# EAGLE design pj7 (EAGLE 7.3.2)
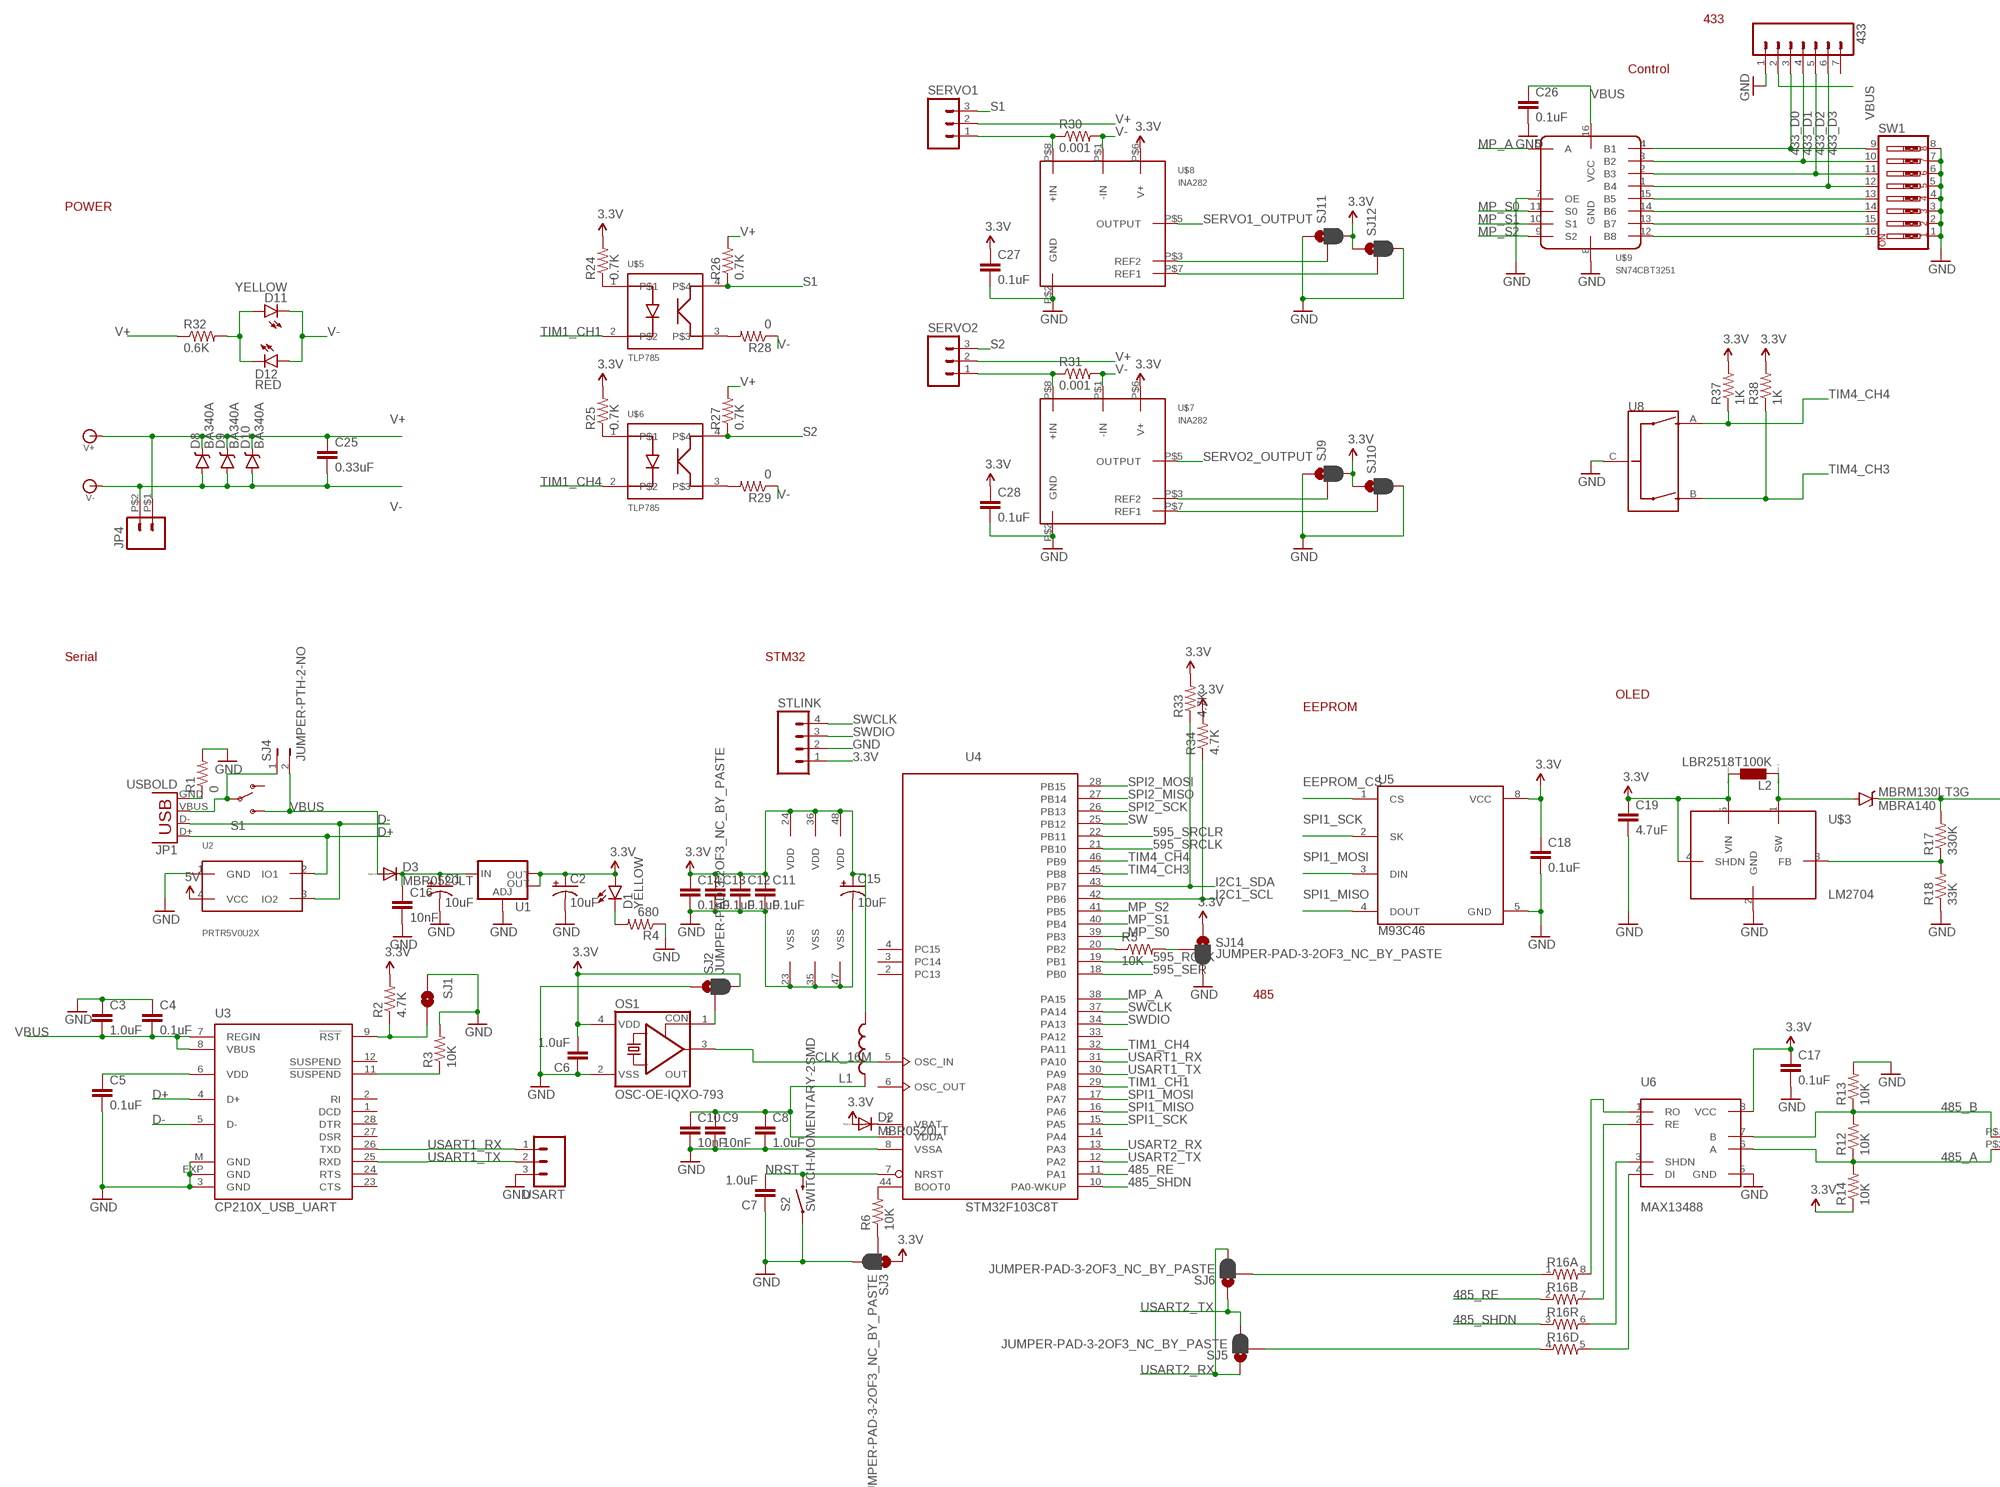
[diagram p0: schematic, sheet 1, part 1 of 2]
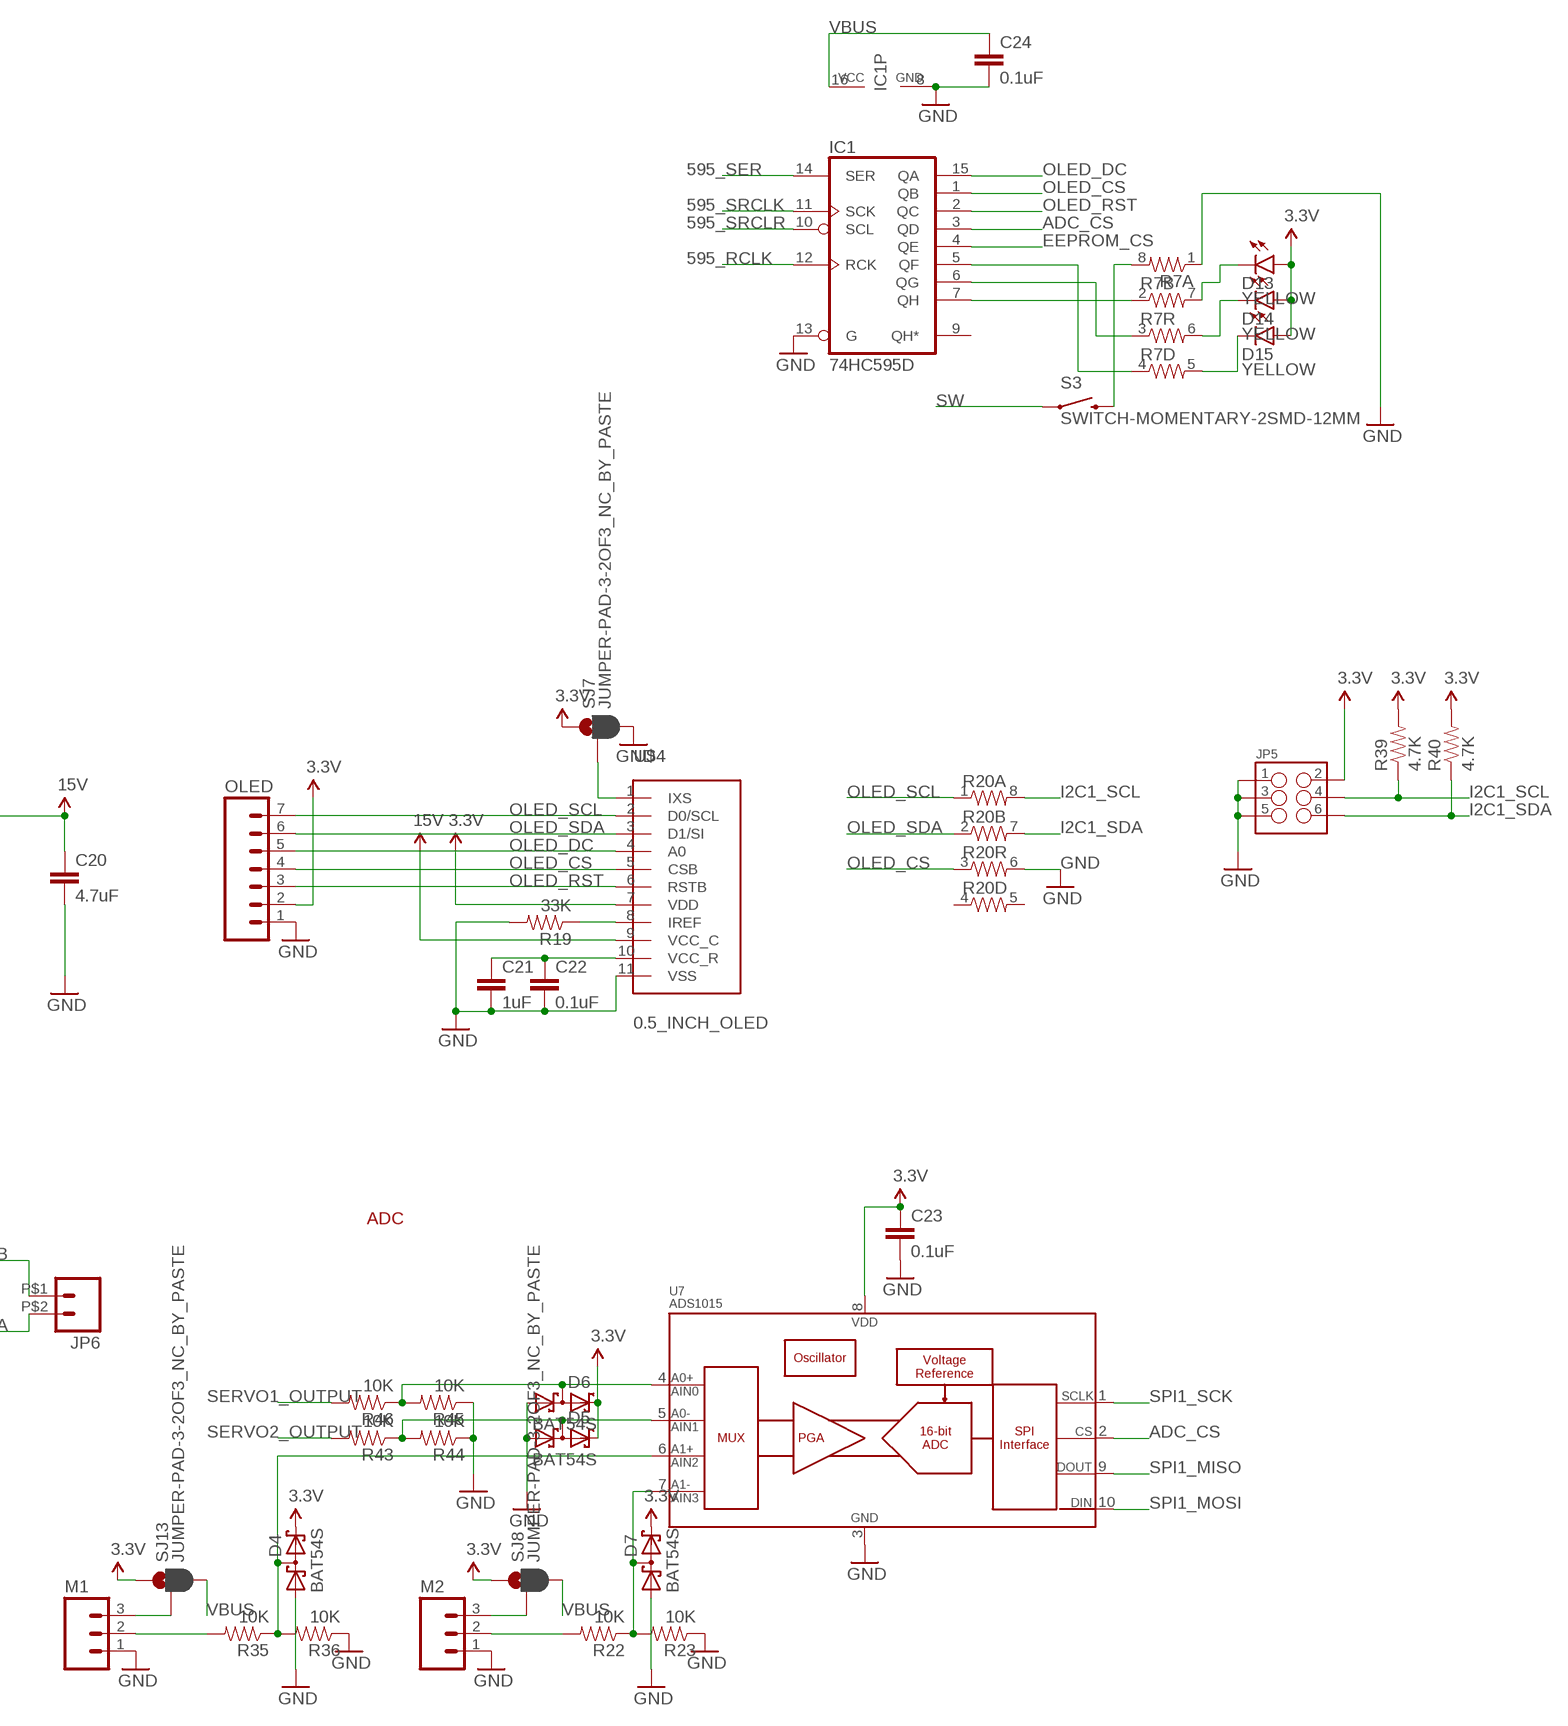
[diagram p1: schematic, sheet 1, part 2 of 2]

## Parts
433  M07LOCK  [1X07_LOCK]
C1  10uF  10UF-16V-10%(TANT)  [EIA3216]
C2  10uF  10UF-16V-10%(TANT)  [EIA3216]
C3  1.0uF  1.0UF-16V-10%(0603)  [0603-CAP]
C4  0.1uF  0.1UF-25V-5%(0603)  [0603-CAP]
C5  0.1uF  0.1UF-25V-5%(0603)  [0603-CAP]
C6  1.0uF  1.0UF-16V-10%(0603)  [0603-CAP]
C7  1.0uF  1.0UF-16V-10%(0603)  [0603-CAP]
C8  1.0uF  1.0UF-16V-10%(0603)  [0603-CAP]
C9  10nF  10NF/10000PF-50V-10%(0603)  [0603-CAP]
C10  10nF  10NF/10000PF-50V-10%(0603)  [0603-CAP]
C11  0.1uF  0.1UF-25V-5%(0603)  [0603-CAP]
C12  0.1uF  0.1UF-25V-5%(0603)  [0603-CAP]
C13  0.1uF  0.1UF-25V-5%(0603)  [0603-CAP]
C14  0.1uF  0.1UF-25V-5%(0603)  [0603-CAP]
C15  10uF  10UF-16V-10%(TANT)  [EIA3216]
C16  10nF  10NF/10000PF-50V-10%(0603)  [0603-CAP]
C17  0.1uF  0.1UF-25V-5%(0603)  [0603-CAP]
C18  0.1uF  0.1UF-25V-5%(0603)  [0603-CAP]
C19  4.7uF  0.1UF-25V-5%(0603)  [0603-CAP]
C20  4.7uF  0.1UF-25V-5%(0603)  [0603-CAP]
C21  1uF  0.1UF-25V-5%(0603)  [0603-CAP]
C22  0.1uF  0.1UF-25V-5%(0603)  [0603-CAP]
C23  0.1uF  0.1UF-25V-5%(0603)  [0603-CAP]
C24  0.1uF  0.1UF-25V-5%(0603)  [0603-CAP]
C25  0.33uF  0.33UF-50V-10%(0805)  [0805-CAP]
C26  0.1uF  0.1UF-25V-5%(0603)  [0603-CAP]
C27  0.1uF  0.1UF-25V-5%(0603)  [0603-CAP]
C28  0.1uF  0.1UF-25V-5%(0603)  [0603-CAP]
D1  YELLOW  LED-YELLOW1206  [LED-1206]
D2  MBR0520LT  [SOD123]
D3  MBR0520LT  [SOD123]
D4  BAT54S  [SOT23]
D5  BAT54S  [SOT23]
D6  BAT54S  [SOT23]
D7  BAT54S  [SOT23]
D8  BA340A  B340A  [SMA-DIODE]
D9  BA340A  B340A  [SMA-DIODE]
D10  BA340A  B340A  [SMA-DIODE]
D11  YELLOW  LED-YELLOW1206  [LED-1206]
D12  RED  LED-RED1206  [LED-1206]
D13  YELLOW  LED-YELLOW1206  [LED-1206]
D14  YELLOW  LED-YELLOW1206  [LED-1206]
D15  YELLOW  LED-YELLOW1206  [LED-1206]
IC1  74HC595D  [SO16]
JP1  USBOLD  [USB-MINIB-OLD]
JP4  M02  [1X02_5.08]
JP5  M03X2  [2X3_SMD]
JP6  M02  [1X02_5.08]
L1  INDUCTOR0603  [0603]
L2  LBR2518T100K  LL3225P  [L3225P]
M1  M03LOCK  [1X03_LOCK]
M2  M03LOCK  [1X03_LOCK]
MBRM130LT3G  MBRA140  [SMA-DIODE]
OLED  M07LOCK  [1X07_LOCK]
OS1  OSC-OE-IQXO-793  [2.5X2-4-PAD]
R1  0  0OHM-1/10W-5%(0603)  [0603]
R2  4.7K  4.7KOHM-1/10W-1%(0603)  [0603-RES]
R3  10K  4.7KOHM-1/10W-1%(0603)  [0603-RES]
R4  680  680OHM1/10W5%(0603)  [0603-RES]
R5  10K  10KOHM-1/10W-1%(0603)0603  [0603-RES]
R6  10K  10KOHM-1/10W-1%(0603)0603  [0603-RES]
R7  RESISTOR-ARRAY0603-ARV  [0603-ARV]
R12  10K  10KOHM-1/10W-1%(0603)0603  [0603-RES]
R13  10K  10KOHM-1/10W-1%(0603)0603  [0603-RES]
R14  10K  10KOHM-1/10W-1%(0603)0603  [0603-RES]
R16  RESISTOR-ARRAY0603-ARV  [0603-ARV]
R17  330K  10KOHM-1/10W-1%(0603)0603  [0603-RES]
R18  33K  10KOHM-1/10W-1%(0603)0603  [0603-RES]
R19  33K  10KOHM-1/10W-1%(0603)0603  [0603-RES]
R20  RESISTOR-ARRAY0603-ARV  [0603-ARV]
R22  10K  10KOHM-1/10W-1%(0603)0603  [0603-RES]
R23  10K  10KOHM-1/10W-1%(0603)0603  [0603-RES]
R24  0.7K  0OHM-1/10W-5%(0603)  [0603]
R25  0.7K  0OHM-1/10W-5%(0603)  [0603]
R26  0.7K  0OHM-1/10W-5%(0603)  [0603]
R27  0.7K  0OHM-1/10W-5%(0603)  [0603]
R28  0  0OHM-1/10W-5%(0603)  [0603]
R29  0  0OHM-1/10W-5%(0603)  [0603]
R30  0.001  0.001OHM-3W-1%(2512)3W/1%  [2512]
R31  0.001  0.001OHM-3W-1%(2512)3W/1%  [2512]
R32  0.6K  0.75OHM-1/4W-1%(0805)  [0805]
R33  4.7K  10KOHM-1/10W-1%(0603)0603  [0603-RES]
R34  4.7K  10KOHM-1/10W-1%(0603)0603  [0603-RES]
R35  10K  10KOHM-1/10W-1%(0603)0603  [0603-RES]
R36  10K  10KOHM-1/10W-1%(0603)0603  [0603-RES]
R37  1K  10KOHM-1/10W-1%(0603)0603  [0603-RES]
R38  1K  10KOHM-1/10W-1%(0603)0603  [0603-RES]
R39  4.7K  10KOHM-1/10W-1%(0603)0603  [0603-RES]
R40  4.7K  10KOHM-1/10W-1%(0603)0603  [0603-RES]
R43  10K  10KOHM-1/10W-1%(0603)0603  [0603-RES]
R44  10K  10KOHM-1/10W-1%(0603)0603  [0603-RES]
R45  10K  10KOHM-1/10W-1%(0603)0603  [0603-RES]
R46  10K  10KOHM-1/10W-1%(0603)0603  [0603-RES]
S1  SWITCH-SPDTSMD  [AYZ0202]
S2  SWITCH-MOMENTARY-2SMD  [TACTILE-SWITCH-SMD]
S3  SWITCH-MOMENTARY-2SMD-12MM  [TACTILE-SMD-12MM]
SERVO1  M03LOCK_LONGPADS  [1X03_LOCK_LONGPADS]
SERVO2  M03LOCK_LONGPADS  [1X03_LOCK_LONGPADS]
SJ1  JUMPER-PAD-2-NOYES_SILK  [PAD-JUMPER-2-NO_YES_SILK]
SJ2  JUMPER-PAD-3-2OF3_NC_BY_PASTE  [PAD-JUMPER-3-2OF3_NC_BY_PASTE_YES_SILK_FULL_BOX]
SJ3  JUMPER-PAD-3-2OF3_NC_BY_PASTE  [PAD-JUMPER-3-2OF3_NC_BY_PASTE_YES_SILK_FULL_BOX]
SJ4  JUMPER-PTH-2-NO  [PTH-JUMPER-2-NO_NO_SILK]
SJ5  JUMPER-PAD-3-2OF3_NC_BY_PASTE  [PAD-JUMPER-3-2OF3_NC_BY_PASTE_YES_SILK_FULL_BOX]
SJ6  JUMPER-PAD-3-2OF3_NC_BY_PASTE  [PAD-JUMPER-3-2OF3_NC_BY_PASTE_YES_SILK_FULL_BOX]
SJ7  JUMPER-PAD-3-2OF3_NC_BY_PASTE  [PAD-JUMPER-3-2OF3_NC_BY_PASTE_YES_SILK_FULL_BOX]
SJ8  JUMPER-PAD-3-2OF3_NC_BY_PASTE  [PAD-JUMPER-3-2OF3_NC_BY_PASTE_YES_SILK_FULL_BOX]
SJ9  JUMPER-PAD-3-2OF3_NC_BY_PASTE  [PAD-JUMPER-3-2OF3_NC_BY_PASTE_YES_SILK_FULL_BOX]
SJ10  JUMPER-PAD-3-2OF3_NC_BY_PASTE  [PAD-JUMPER-3-2OF3_NC_BY_PASTE_YES_SILK_FULL_BOX]
SJ11  JUMPER-PAD-3-2OF3_NC_BY_PASTE  [PAD-JUMPER-3-2OF3_NC_BY_PASTE_YES_SILK_FULL_BOX]
SJ12  JUMPER-PAD-3-2OF3_NC_BY_PASTE  [PAD-JUMPER-3-2OF3_NC_BY_PASTE_YES_SILK_FULL_BOX]
SJ13  JUMPER-PAD-3-2OF3_NC_BY_PASTE  [PAD-JUMPER-3-2OF3_NC_BY_PASTE_YES_SILK_FULL_BOX]
SJ14  JUMPER-PAD-3-2OF3_NC_BY_PASTE  [PAD-JUMPER-3-2OF3_NC_BY_PASTE_YES_SILK_FULL_BOX]
STLINK  M04LOCK  [1X04_LOCK]
SW1  SW_DIP-8-SMT-HALFSIZE  [DIPSWITCH-08-50MIL]
U1  V_REG_LM1117SOT223  [SOT223]
U2  PRTR5V0U2X  [SOT143]
U3  CP210X_USB_UART  [MLP28]
U4  STM32F103C8T  [LQFP48]
U5  M93C46  [SO08]
U6  MAX13488  [SOIC8]
U7  ADS1015  ADS1118  [MSOP10]
U8  ENCODER-QUADRATURE  [ENCODER-16MM-QUAD]
U$3  LM2704  [SOT23-5]
U$4  0.5_INCH_OLED  [BL125-11RL-TAGF]
U$5  TLP785  [DIL04]
U$6  TLP785  [DIL04]
U$7  INA282  [SOP8]
U$8  INA282  [SOP8]
U$9  SN74CBT3251  [TSSOP16]
USART  M03LOCK  [1X03_LOCK]
V+  BANANA_CONN  [BANANA_CONN]
V-  BANANA_CONN  [BANANA_CONN]

## Nets
3.3V: C2.A(+) C6.2 C11.1 C12.1 C13.1 C14.1 C15.A(+) C17.1 C18.1 C19.1 C23.1 C27.1 C28.1 D1.A D2.A D4.2(C2) D5.2(C2) D6.2(C2) D7.2(C2) D13.A D14.A D15.A JP5.2 L1.2 L2.1 OLED.2 OS1.4(VDD) R2.2 R14.1 R24.2 R25.2 R33.2 R34.2 R37.2 R38.2 R39.2 R40.2 SJ2.3 SJ3.1 SJ7.1 SJ8.1 SJ9.3 SJ10.1 SJ11.3 SJ12.1 SJ13.1 SJ14.1 STLINK.1 U1.2(OUT) U1.4(OUT) U4.24(VDD) U4.36(VDD) U4.48(VDD) U5.8(VCC) U6.8(VCC) U7.8(VDD) U$3.4(SHDN) U$3.5(VIN) U$4.7(VDD) U$7.P$6(V+) U$8.P$6(V+)
5V: U2.4(VCC)
15V: C20.1 MBRM130LT3G.C R17.2 U$4.9(VCC_C)
433_D0: 433.3 SW1.9 U$9.4(B1)
433_D1: 433.4 SW1.10 U$9.3(B2)
433_D2: 433.5 SW1.11 U$9.2(B3)
433_D3: 433.6 SW1.12 U$9.1(B4)
485_A: JP6.P$2 R12.1 R14.2 U6.6(A)
485_B: JP6.P$1 R12.2 R13.1 U6.7(B)
485_RE: R16.2 U4.11(PA1)
485_SHDN: R16.3 U4.10(PA0-WKUP)
595_RCLK: IC1.12(RCK) U4.19(PB1)
595_SER: IC1.14(SER) U4.18(PB0)
595_SRCLK: IC1.11(SCK) U4.21(PB10)
595_SRCLR: IC1.10(SCL) U4.22(PB11)
ADC_CS: IC1.3(QD) U7.2(CS)
CLK_16M: OS1.3(OUT) U4.5(OSC_IN)
D+: JP1.D+ U2.2(IO1) U3.4(D+)
D-: JP1.D- U2.3(IO2) U3.5(D-)
EEPROM_CS: IC1.4(QE) U5.1(CS)
GND: 433.1 C1.C(-) C2.C(-) C3.1 C4.1 C5.2 C6.1 C7.1 C8.2 C9.2 C10.2 C11.2 C12.2 C13.2 C14.2 C15.C(-) C16.2 C17.2 C18.2 C19.2 C20.2 C21.2 C22.2 C23.2 C24.2 C26.2 C27.2 C28.2 D4.1(A1) D5.1(A1) D6.1(A1) D7.1(A1) IC1.8(GND) IC1.13(G) JP5.1 JP5.3 JP5.5 M1.1 M2.1 OLED.1 OS1.2(VSS) R1.2 R3.2 R4.1 R7.1 R13.2 R18.1 R19.2 R20.6 R23.1 R36.1 R44.1 R45.1 S2.1 SJ1.2 SJ2.1 SJ3.3 SJ7.3 SJ9.1 SJ10.3 SJ11.1 SJ12.3 SJ14.3 STLINK.2 SW1.1 SW1.2 SW1.3 SW1.4 SW1.5 SW1.6 SW1.7 SW1.8 U1.1(ADJ) U2.1(GND) U3.3(GND) U3.EXP(GND) U3.M(GND) U4.8(VSSA) U4.23(VSS) U4.35(VSS) U4.47(VSS) U5.5(GND) U6.5(GND) U7.3(VSS) U8.C U$3.2(GND) U$4.11(VSS) U$7.P$2(GND) U$8.P$2(GND) U$9.7(OE) U$9.8(GND) USART.3
I2C1_SCL: JP5.4 R20.8 R34.1 R39.1 U4.42(PB6)
I2C1_SDA: JP5.6 R20.7 R33.1 R40.1 U4.43(PB7)
MP_A: U4.38(PA15) U$9.5(A)
MP_S0: U4.39(PB3) U$9.11(S0)
MP_S1: U4.40(PB4) U$9.10(S1)
MP_S2: U4.41(PB5) U$9.9(S2)
N$1: JP1.GND R1.1
N$2: R3.1 U3.11(!SUSPEND)
N$3: D1.C R4.2
N$4: D2.C U4.1(VBAT)
N$5: JP1.VBUS S1.2(P) SJ4.1
N$6: C8.1 C9.1 C10.1 L1.1 U4.9(VDDA)
N$7: R6.2 U4.44(BOOT0)
N$9: R6.1 SJ3.2
N$10: R2.1 SJ1.1 U3.9(!RST)
N$11: OS1.1(CON) SJ2.2
N$12: C1.A(+) C16.1 D3.C U1.3(IN)
N$14: R17.1 R18.2 U$3.3(FB)
N$15: C5.1 U3.6(VDD)
N$16: IC1.7(QH) R7.2
N$17: IC1.6(QG) R7.3
N$18: L2.2 MBRM130LT3G.A U$3.1(SW)
N$19: IC1.5(QF) R7.4
N$20: C21.1 C22.1 U$4.10(VCC_R)
N$21: SJ7.2 U$4.1(IXS)
N$22: D15.C R7.5
N$23: D14.C R7.6
N$24: R16.8 U6.1(RO)
N$25: R16.6 U6.3(SHDN)
N$26: R16.5 U6.4(DI)
N$27: R16.7 U6.2(RE)
N$28: R16.1 SJ6.2
N$29: R24.1 U$5.1
N$30: M2.2 R22.2
N$31: R16.4 SJ5.2
N$32: R19.1 U$4.8(IREF)
N$33: D7.3(C1A2) R22.1 R23.2 U7.7(AIN3)
N$34: R25.1 U$6.1
N$35: R30.1 SERVO1.1 U$8.P$8(+IN)
N$36: M2.3 SJ8.2
N$37: R31.1 SERVO2.1 U$7.P$8(+IN)
N$38: R28.2 U$5.3
N$39: R29.2 U$6.3
N$40: SJ9.2 U$7.P$3(REF2)
N$41: SJ10.2 U$7.P$7(REF1)
N$42: SJ11.2 U$8.P$3(REF2)
N$43: SJ12.2 U$8.P$7(REF1)
N$44: D11.A D12.C R32.2
N$45: M1.3 SJ13.2
N$46: D4.3(C1A2) R35.1 R36.2 U7.6(AIN2)
N$47: M1.2 R35.2
N$48: R5.2 SJ14.2
N$49: D5.3(C1A2) R43.1 R44.2 U7.5(AIN1)
N$50: D6.3(C1A2) R45.2 R46.1 U7.4(AIN0)
N$55: SW1.13 U$9.15(B5)
N$56: SW1.14 U$9.14(B6)
N$57: SW1.15 U$9.13(B7)
N$58: SW1.16 U$9.12(B8)
N$59: D13.C R7.7
N$63: R7.8 S3.3
NRST: C7.2 S2.3 U4.7(NRST)
OLED_CS: IC1.1(QB) OLED.4 R20.3 U$4.5(CSB)
OLED_DC: IC1.15(QA) OLED.5 U$4.4(A0)
OLED_RST: IC1.2(QC) OLED.3 U$4.6(RSTB)
OLED_SCL: OLED.7 R20.1 U$4.2(D0/SCL)
OLED_SDA: OLED.6 R20.2 U$4.3(D1/SI)
OURET: R5.1 U4.20(PB2)
S1: R26.1 SERVO1.3 U$5.4
S2: R27.1 SERVO2.3 U$6.4
SERVO1_OUTPUT: R46.2 U$8.P$5(OUTPUT)
SERVO2_OUTPUT: R43.2 U$7.P$5(OUTPUT)
SPI1_MISO: U4.16(PA6) U5.4(DOUT) U7.9(DOUT/DRDY)
SPI1_MOSI: U4.17(PA7) U5.3(DIN) U7.10(DIN)
SPI1_SCK: U4.15(PA5) U5.2(SK) U7.1(SCLK)
SPI2_MISO: U4.27(PB14)
SPI2_MOSI: U4.28(PB15)
SPI2_SCK: U4.26(PB13)
SW: S3.1 U4.25(PB12)
SWCLK: STLINK.4 U4.37(PA14)
SWDIO: STLINK.3 U4.34(PA13)
TIM1_CH1: U4.29(PA8) U$5.2
TIM1_CH4: U4.32(PA11) U$6.2
TIM4_CH3: R38.1 U4.45(PB8) U8.B
TIM4_CH4: R37.1 U4.46(PB9) U8.A
USART1_RX: U3.26(TXD) U4.31(PA10) USART.1
USART1_TX: U3.25(RXD) U4.30(PA9) USART.2
USART2_RX: SJ5.1 SJ6.3 U4.13(PA3)
USART2_TX: SJ5.3 SJ6.1 U4.12(PA2)
V+: C25.1 D8.C D9.C D10.C JP4.P$1 R26.2 R27.2 R32.1 SERVO1.2 SERVO2.2 V+.P$1
V-: C25.2 D8.A D9.A D10.A D11.C D12.A JP4.P$2 R28.1 R29.1 R30.2 R31.2 U$7.P$1(-IN) U$8.P$1(-IN) V-.P$1
VBUS: 433.2 C3.2 C4.2 C24.1 C26.1 D3.A IC1.16(VCC) S1.3(S) SJ4.2 SJ8.3 SJ13.3 U3.7(REGIN) U3.8(VBUS) U$9.16(VCC)
Unconnected: 433.7 IC1.9(QH*) R20.4 R20.5 S1.1(O) U3.1(DCD) U3.2(RI) U3.12(SUSPEND) U3.23(CTS) U3.24(RTS) U3.27(DSR) U3.28(DTR) U4.2(PC13) U4.3(PC14) U4.4(PC15) U4.6(OSC_OUT) U4.14(PA4) U4.33(PA12)

## Notes on the sheet
- 433
- Control
- POWER
- Serial | STM32
- OLED
- EEPROM
- 485
- ADC

## Library data of the parts
433 OLED = SparkFun-Connectors:M07: Header 7 Standard 7-pin 0.1" header. Use with straight break away headers (SKU : PRT-00116), right angle break away headers (PRT-00553), swiss pins (PRT-00743), machine pins (PRT-00117), and female headers (PRT-00115). NOTES ON THE VARIANTS LOCK and LOCK_LONGPADS... This footprint was designed to help hold the alignment of a through-hole component (i.e. 7-pin header) while soldering it into place. You may notice that each hole has been shifted either up or down by 0.005 of an inch from it's more standard position (which is usually a perfectly straight line). This slight alteration caused the pins (the squares in the middle) to touch the edges of the holes. Because they are alternating, it causes a "brace" to hold the header in place. 0.005 has proven to be the perfect amount of "off-center" position when using our standard breakaway headers. Although looks a little odd when you look at the bare footprint, once you have a header in there, the alteration is very hard to notice. Also, if you push a header all the way into place, it is covered up entirely on the bottom side. This idea of altering the position of holes to aid alignment will be further integrated into the Sparkfun Library for other footprints. It can help hold any component with 3 or more connection pins.
C1 C2 C15 = SparkFun-Capacitors:10UF-16V-10%(TANT): CAP-00811 1206/EIA-3216 Tantalum capacitor; PROD_ID: CAP-00811
C3 C6-C8 = SparkFun-Capacitors:1.0UF-16V-10%(0603): CAP-00868; PROD_ID: CAP-00868
C4 C5 C11-C14 C17 C18 C22-C24 C26-C28 = SparkFun-Capacitors:0.1UF-25V-5%(0603): CAP-08604; PROD_ID: CAP-08604
C9 C10 C16 = SparkFun-Capacitors:10NF/10000PF-50V-10%(0603): CAP-00867; PROD_ID: CAP-00867
C19-C21 = SparkFun-Capacitors:0.1UF-25V-5%(0603): CAP-08604; PROD_ID: CAP-08604; VALUE: 0.1uF
C25 = SparkFun-Capacitors:0.33UF-50V-10%(0805): CAP-08469; PROD_ID: CAP-08469
D1 D11 D13-D15 = SparkFun-LED:LED-YELLOW: Yellow SMD LEDs LilyPad 1206- DIO-09909 0603- DIO-09003 "SMART" means more efficient and expensive; PROD_ID: DIO-00820
D2 D3 = diode:MBR0520LT: SCHOTTKY BARRIER RECTIFIER Source: http://onsemi.com .. MBR0520LT1-D.pdf
D4-D7 = diode:BAT54S: Schottky Diodes Pin connection corrected 2011-05-04 Source: Fairchild .. BAT54.pdf
D8-D10 = SparkFun-DiscreteSemi:B340A: Schottky Diode 3A-40V; PROD_ID: DIO-09886
D12 = SparkFun-LED:LED-RED: Assorted Red LEDs LilyPad 1206- DIO-09912 1206- DIO-00809 0603- DIO-00819 "SMART" means more efficient and expensive; PROD_ID: DIO-09912
IC1 = 74xx-eu:74*595: 8-bit SHIFT REGISTER, output latch
JP1 = SparkFun-Connectors:USB: USB Connectors USB-B-PTH is fully proven SKU : PRT-00139/CONN-08278 USB-miniB is fully proven SKU : PRT-00587 USB-A-PCB is untested. USB-A-H is throughly reviewed, but untested. Spark Fun Electronics SKU : PRT-00437 USB-B-SMT is throughly reviewed, but untested. Needs silkscreen touching up. USB-A-S has not been used/tested USB-MB-H has not been used/tested USB-MICROB has been used. CONN-09505
JP4 JP6 = SparkFun-Connectors:M02: Standard 2-pin 0.1" header. Use with - straight break away headers ( PRT-00116) - right angle break away headers (PRT-00553) - swiss pins (PRT-00743) - machine pins (PRT-00117) - female headers (PRT-00115) Molex polarized connector foot print use with: PRT-08233 with associated crimp pins and housings. 2.54_SCREWTERM for use with PRT-10571. 3.5mm Screw Terminal footprints for PRT-08084 5mm Screw Terminal footprints for use with PRT-08432
JP5 = SparkFun-Connectors:M03X2: 2x3 .1" header. Shrouded, with keying- CONN-10681 SMT- CONN-11415 Pogo pins- HW-11044; PROD_ID: CONN-11290
L1 = SparkFun-Passives:INDUCTOR: Inductors Basic Inductor/Choke - 0603 and 1206. Footprints are not proven and vary greatly between part numbers. INDUCTOR POWER 3.3UH 4.0A SMD 0.197" L x 0.197" W x 0.177" H (5.00mm x 5.00mm x 4.50mm)
L2 = eagle-ltspice:L: INDUCTOR, European symbol; SPICEMODEL: NONE; SPICEPREFIX: L
M1 M2 SERVO1 SERVO2 USART = SparkFun-Connectors:M03: Header 3 Standard 3-pin 0.1" header. Use with straight break away headers (SKU : PRT-00116), right angle break away headers (PRT-00553), swiss pins (PRT-00743), machine pins (PRT-00117), and female headers (PRT-00115). Molex polarized connector foot print use with SKU : PRT-08232 with associated crimp pins and housings.
MBRM130LT3G = SparkFun-DiscreteSemi:MBRA140: 40V, 1A Schottky rectifier SMA/DO-214AC package DIO-08053; PROD_ID: DIO-08053
OS1 = IQD-Frequency-Products:OSC-OE: OSCILLATOR WITH OE
R1 R28 R29 = SparkFun-Resistors:0OHM-1/10W-5%(0603): RES-08609; PROD_ID: RES-08609
R2 = SparkFun-Resistors:4.7KOHM-1/10W-1%(0603): RES-07857; PROD_ID: RES-07857
R3 = SparkFun-Resistors:4.7KOHM-1/10W-1%(0603): RES-07857; PROD_ID: RES-07857; VALUE: 4.7K
R4 = SparkFun-Resistors:680OHM1/10W5%(0603): RES-09333; PROD_ID: RES-09333
R5 R6 R12-R14 R22 R23 R35 R36 R43-R46 = SparkFun-Resistors:10KOHM-1/10W-1%(0603): RES-00824; PROD_ID: RES-00824
R7 R16 R20 = SparkFun-Resistors:RESISTOR-ARRAY: Array Chip Resistor Source: RS Component / Phycomp
R17-R19 R33 R34 R37-R40 = SparkFun-Resistors:10KOHM-1/10W-1%(0603): RES-00824; PROD_ID: RES-00824; VALUE: 10K
R24-R27 = SparkFun-Resistors:0OHM-1/10W-5%(0603): RES-08609; PROD_ID: RES-08609; VALUE: 0
R30 R31 = SparkFun-Resistors:0.001OHM-3W-1%(2512); PROD_ID: RES-12449
R32 = SparkFun-Resistors:0.75OHM-1/4W-1%(0805): RES-08474; PROD_ID: RES-08474; VALUE: 0.75
S1 = SparkFun-Electromechanical:SWITCH-SPDT: SPDT Switch Simple slide switch, Spark Fun Electronics SKU : COM-00102 DPDT SMT slide switch, AYZ0202, SWCH-08179; PROD_ID: SWCH-08179; SF_ID: COM-00597
S2 = SparkFun-Electromechanical:SWITCH-MOMENTARY-2: Various NO switches- pushbuttons, reed, etc; PROD_ID: SWCH-08247
S3 = SparkFun-Electromechanical:SWITCH-MOMENTARY-2: Various NO switches- pushbuttons, reed, etc
SJ1 = SparkFun-Passives:JUMPER-PAD-2-NO
SJ2 SJ3 SJ5-SJ14 = SparkFun-Passives:JUMPER-PAD-3-2OF3_NC_BY_PASTE
SJ4 = SparkFun-Passives:JUMPER-PTH-2-NO
STLINK = SparkFun-Connectors:M04: Header 4 Standard 4-pin 0.1" header. Use with straight break away headers (SKU : PRT-00116), right angle break away headers (PRT-00553), swiss pins (PRT-00743), machine pins (PRT-00117), and female headers (PRT-00115). Molex polarized connector foot print use with SKU : PRT-08231 with associated crimp pins and housings. 1MM SMD Version SKU: PRT-10208
SW1 = SparkFun-Electromechanical:SW_DIP-8: DIP Switch 8 Position
U1 = SparkFun-PowerIC:V_REG_LM1117: Voltage Regulator LM1117 Standard adjustable voltage regulator but in SMD form. Spark Fun Electronics SKU : COM-00595; PROD_ID: VREG-08170
U2 = semicon-smd-ipc:PRTR5V0U2X
U3 = SparkFun-DigitalIC:CP210X_USB_UART: Single-Chip USB to UART Bridge Source: www.silabs.com .. CP2101.pdf / cp2102.pdf. Spark Fun Electronics SKU : COM-00310
U4 = micro-stm_v3:STM32F103C*T: ARM 32-bit Cortex™-M3 CPU 72 MHz maximum frequency 16 to 128 Kbytes of Flash memory 6 to 20 kbytes of SRAM 37 GPIOs 2.0 to 3.6 V application supply
U5 = SparkFun-DigitalIC:M93C46: 1kbit SPI EEPROM
U6 = SparkFun-DigitalIC:MAX13488
U7 = SparkFun-AnalogIC:ADS1118: 12-Bit Del-Sig ADC Four single-ended inputs or two differential inputs Internal PGA I2C interface 2.0-5.5V; PROD_ID: IC-12239
U8 = SparkFun-Electromechanical:ENCODER-QUADRATURE: quadrature encoder from Top-Up, part#EC16PHBF-B-20F-24-24C-16Y
U$3 = SparkFun-PowerIC:LM2704
U$4 = r1:0.5_INCH_OLED
U$5 U$6 = SparkFun-DigitalIC:TLP785
U$7 U$8 = SparkFun-PowerIC:INA282
U$9 = SparkFun-DigitalIC:SN74CBT3251
V+ V- = SparkFun-Connectors:BANANA_CONN: Through-hole banana jack

## Board
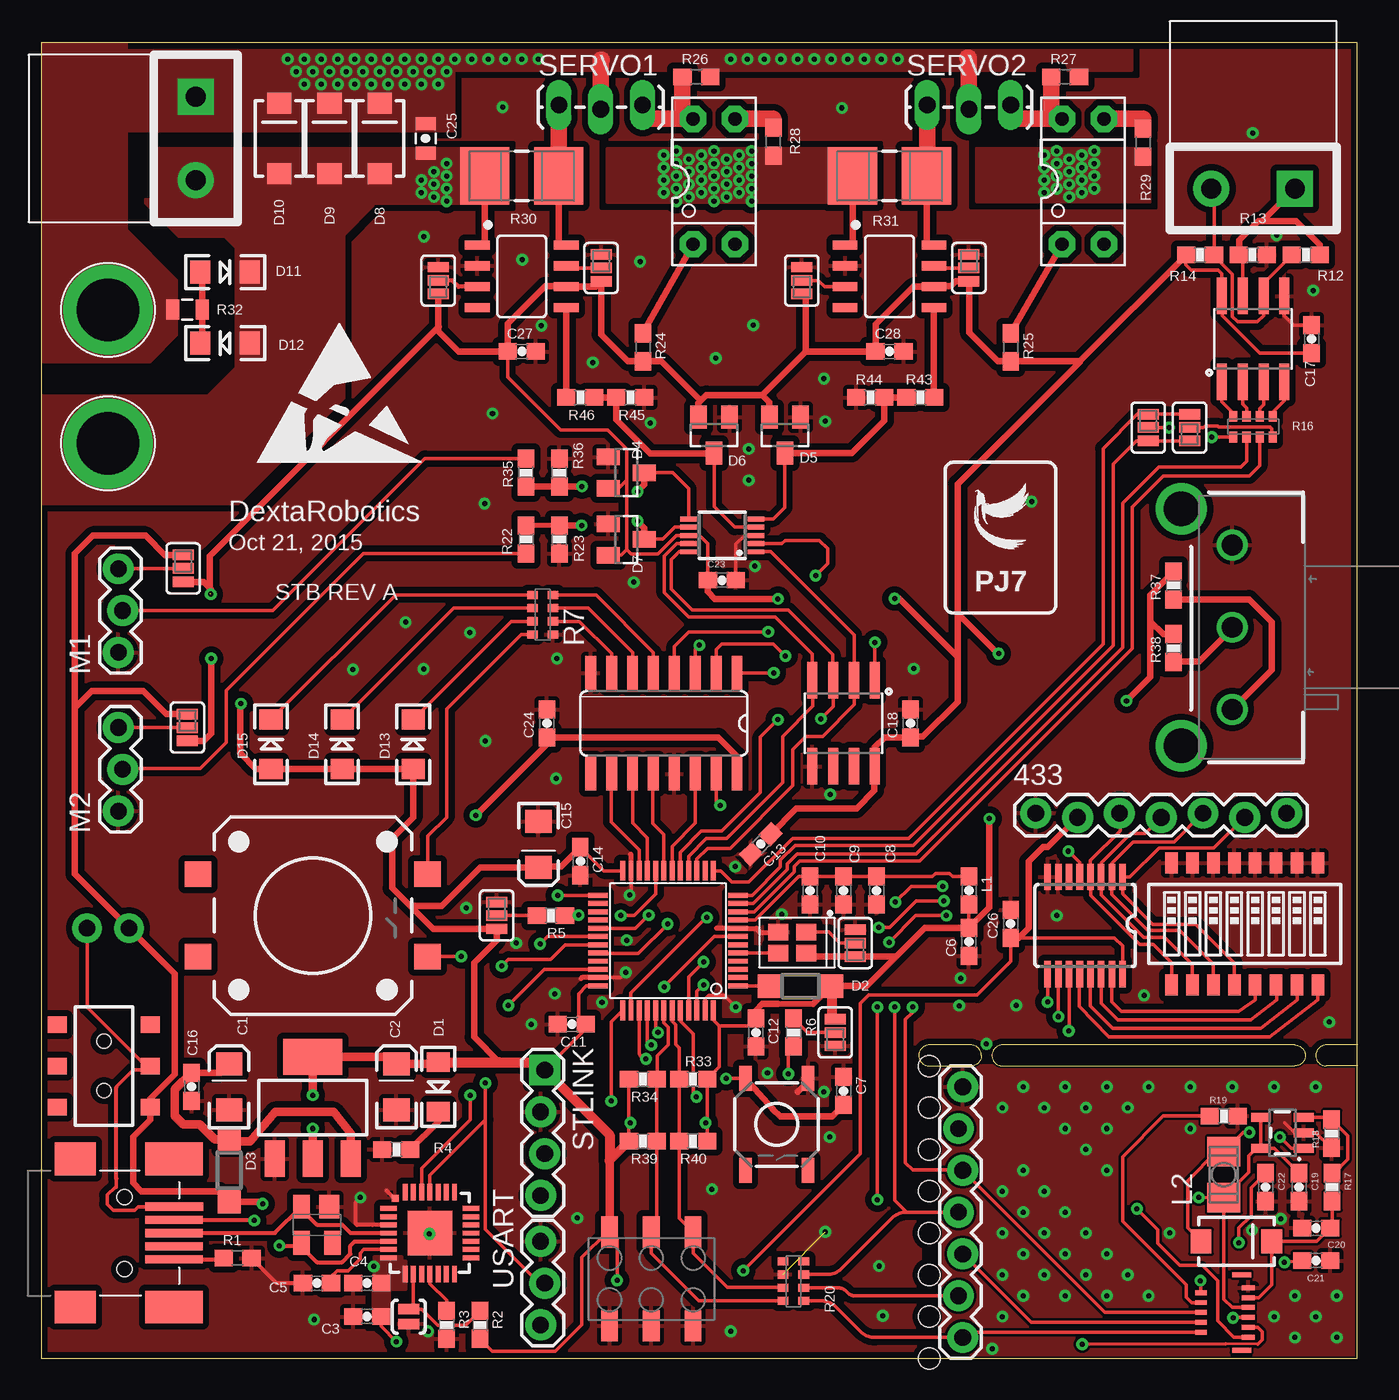
[diagram p2: board, top side]
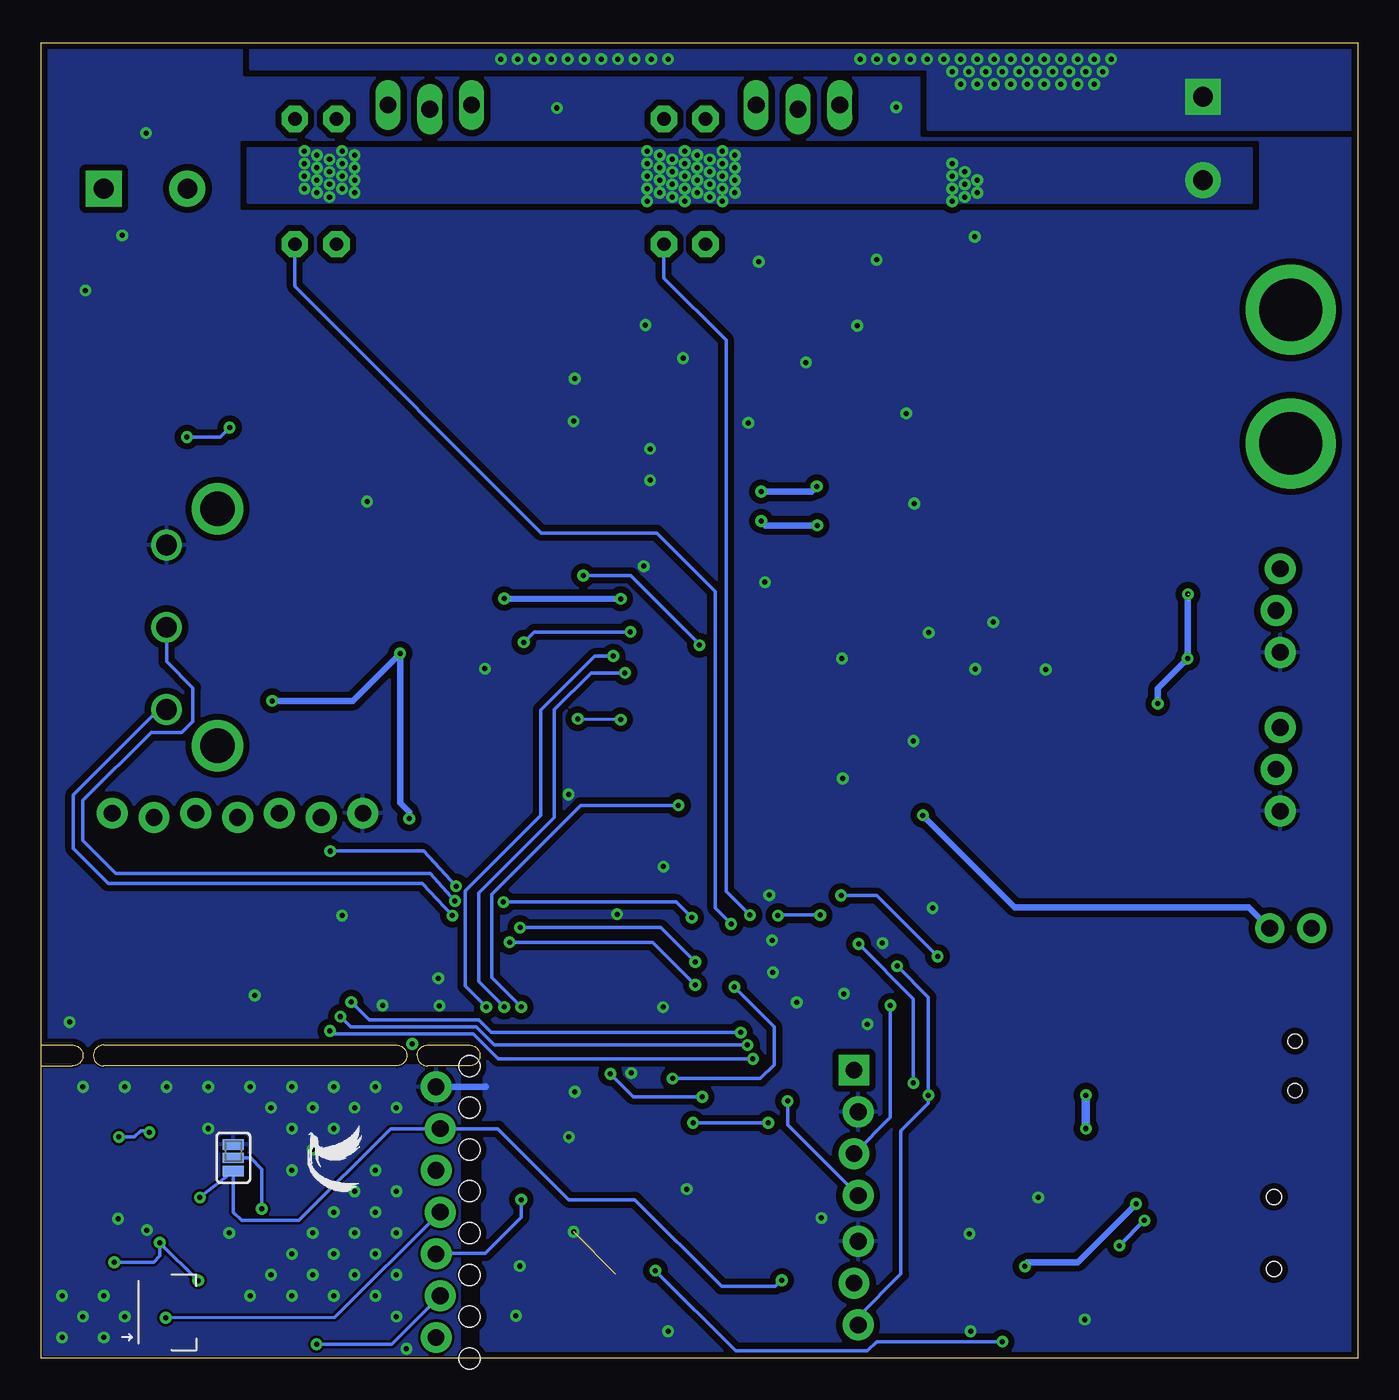
[diagram p3: board, bottom side, seen from below]

Size 80.01 x 80 mm. Coordinates in mm from the lower left corner, seen from the top.
Outline: 80.01,17.78 78.11,17.78 arc-90 77.47,18.41 arc-90 78.11,19.05 80.01,19.05
Outline: 0,0 80,0 80,80 0,80 0,0
Outline: 76.2,19.05 58.42,19.05 arc90 57.78,18.41 arc90 58.42,17.78 76.2,17.78 arc90 76.83,18.41 arc90 76.2,19.05
Outline: 53.98,17.78 56.52,17.78 arc90 57.15,18.41 arc90 56.52,19.05 53.98,19.05 arc90 53.34,18.41 arc90 53.98,17.78
Copper layers (1*16): Top 0.035mm / dielectric 1.5mm / Bottom 0.035mm
Design rules "default *": minimum track width 6mil, minimum drill 12mil, track to track 6mil, track to pad 6mil, pad to pad 6mil, via to via 6mil, smd to smd 6mil, copper to edge 1mil, drill to drill 6mil, minimum pad ring 10mil, minimum via ring 8mil, stop-mask expansion 0mil, vias tented up to drill 15mil, thermal gap 10mil
Holes 1.27 mm at 53.98,15.24 53.98,12.7 53.98,10.16 53.98,7.62 53.98,5.08 53.98,2.54 53.98,0 53.98,17.78

### Footprints (pad centres in the part's own frame; a part is rotated, then mirrored left to right if it is on the bottom)
1X07_LOCK = drill 1.016 pad 1.88: 1 0,0.127; 2 2.54,-0.127; 3 5.08,0.127; 4 7.62,-0.127; 5 10.16,0.127; 6 12.7,-0.127; 7 15.24,0.127
EIA3216 = smd 1.4 x 1.6: A 1.4,0; C -1.4,0
0603-CAP = smd 1.1 x 1: 1 -0.85,0; 2 0.85,0
0805-CAP = smd 0.8 x 1.2: 1 -0.9,0; 2 0.9,0
LED-1206 = smd 1.2 x 1.4: A -1.5,0; C 1.5,0
SOD123 = smd 1.4 x 1.4: A 1.9,0; C -1.9,0
SOT23 = smd 1 x 1.4: 1 -0.95,-1.1; 2 0.95,-1.1; 3 0,1.1
SMA-DIODE = smd 1.27 x 1.47: A -2.15,0; C 2.15,0
SO16 = smd 0.66 x 2.032: 1 -4.445,-3.073; 2 -3.175,-3.073; 3 -1.905,-3.073; 4 -0.635,-3.073; 5 0.635,-3.073; 6 1.905,-3.073; 7 3.175,-3.073; 8 4.445,-3.073; 9 4.445,3.073; 10 3.175,3.073; 11 1.905,3.073; 12 0.635,3.073; 13 -0.635,3.073; 14 -1.905,3.073; 15 -3.175,3.073; 16 -4.445,3.073
USB-MINIB-OLD = smd 2.5 x 2: 1 -3,-4.5; 2 -3,4.5 | smd 3.5 x 2: 3 3,-4.5; 4 3,4.5 | smd 3.5 x 0.5: D+ 3,0; D- 3,0.8; GND 3,-1.6; ID 3,-0.8; VBUS 3.01,1.61 | hole 0.9: 0,2.2; 0,-2.2
1X02_5.08 = drill 1.2 pad 2.184 square: P$1 -2.54,0 | drill 1.2 pad 2.184: P$2 2.54,0
2X3_SMD = smd 1.02 x 1.9: 1 -2.54,-2.85; 2 -2.54,2.85; 3 0,-2.85; 4 0,2.85; 5 2.54,-2.85; 6 2.54,2.85
0603 = smd 1.1 x 1: 1 -0.85,0; 2 0.85,0
L3225P = smd 1.8 x 2: 1 -1.4,0; 2 1.4,0
1X03_LOCK = drill 1.016 pad 1.88: 1 0,0.127; 2 2.54,-0.127; 3 5.08,0.127
2.5X2-4-PAD = smd 1.2 x 1: 1 -0.85,-0.65; 2 0.85,-0.65; 3 0.85,0.65; 4 -0.85,0.65
0603-RES = smd 1.1 x 1: 1 -0.85,0; 2 0.85,0
0603-ARV = smd 0.5 x 0.65: 1 -1.2,-0.625; 2 -0.4,-0.625; 3 0.4,-0.625; 4 1.2,-0.625; 5 1.2,0.625; 6 0.4,0.625; 7 -0.4,0.625; 8 -1.2,0.625
2512 = smd 3 x 3.5: 1 -2.25,0; 2 2.25,0
0805 = smd 0.8 x 1.2: 1 -0.9,0; 2 0.9,0
AYZ0202 = smd 1 x 1.15: 1 -2.5,2.825; 2 0,2.825; 3 2.5,2.825; 4 -2.5,-2.825; 5 0,-2.825; 6 2.5,-2.825 | hole 0.85: 1.5,0; -1.5,0
TACTILE-SWITCH-SMD = smd 1.524 x 0.762: 1 -2.794,1.905; 2 2.794,1.905; 3 -2.794,-1.905; 4 2.794,-1.905
TACTILE-SMD-12MM = smd 1.6 x 1.55: 1 6.975,-2.5; 2 -6.975,-2.5; 3 6.975,2.5; 4 -6.975,2.5
1X03_LOCK_LONGPADS = drill 1.016 long: 1 0,0; 2 2.54,-0.254; 3 5.08,0
PAD-JUMPER-2-NO_YES_SILK = smd 0.635 x 1.27: 1 -0.45,0; 2 0.45,0
PAD-JUMPER-3-2OF3_NC_BY_PASTE_YES_SILK_FULL_BOX = smd 0.635 x 1.27: 1 -0.813,0; 2 0,0; 3 0.813,0
PTH-JUMPER-2-NO_NO_SILK = drill 1.016 pad 1.778: 1 -1.27,0; 2 1.27,0
1X04_LOCK = drill 1.016 pad 1.88 square: 1 0,0.127 | drill 1.016 pad 1.88: 2 2.54,-0.127; 3 5.08,0.127; 4 7.62,-0.127
DIPSWITCH-08-50MIL = smd 0.762 x 1.27: 1 -4.445,-3.7; 2 -3.175,-3.7; 3 -1.905,-3.7; 4 -0.635,-3.7; 5 0.635,-3.7; 6 1.905,-3.7; 7 3.175,-3.7; 8 4.445,-3.7; 9 4.445,3.7; 10 3.175,3.7; 11 1.905,3.7; 12 0.635,3.7; 13 -0.635,3.7; 14 -1.905,3.7; 15 -3.175,3.7; 16 -4.445,3.7
SOT223 = smd 1.219 x 2.235: 1 -2.311,-3.099; 2 0,-3.099; 3 2.311,-3.099 | smd 3.6 x 2.2: 4 0,3.099
SOT143 = smd 1.2 x 1.44: 1 -0.75,-1.1 | smd 1 x 1.44: 2 0.95,-1.1; 3 0.95,1.1; 4 -0.95,1.1
MLP28 = smd 1 x 0.3: 1 -2.5,1.5; 2 -2.5,1; 3 -2.5,0.5; 4 -2.5,0; 5 -2.5,-0.5; 6 -2.5,-1; 7 -2.5,-1.5; 15 2.5,-1.5; 16 2.5,-1; 17 2.5,-0.5; 18 2.5,0; 19 2.5,0.5; 20 2.5,1; 21 2.5,1.5 | smd 0.3 x 1: 8 -1.5,-2.5; 9 -1,-2.5; 10 -0.5,-2.5; 11 0,-2.5; 12 0.5,-2.5; 13 1,-2.5; 14 1.5,-2.5; 22 1.5,2.5; 23 1,2.5; 24 0.5,2.5; 25 0,2.5; 26 -0.5,2.5; 27 -1,2.5; 28 -1.5,2.5 | smd 2.7 x 2.7: EXP 0,0 | smd 0.435 x 0.435: M -2.103,2.103
LQFP48 = smd 0.3 x 1.2: 1 -2.75,-4.25; 2 -2.25,-4.25; 3 -1.75,-4.25; 4 -1.25,-4.25; 5 -0.75,-4.25; 6 -0.25,-4.25; 7 0.25,-4.25; 8 0.75,-4.25; 9 1.25,-4.25; 10 1.75,-4.25; 11 2.25,-4.25; 12 2.75,-4.25; 25 2.75,4.25; 26 2.25,4.25; 27 1.75,4.25; 28 1.25,4.25; 29 0.75,4.25; 30 0.25,4.25; 31 -0.25,4.25; 32 -0.75,4.25; 33 -1.25,4.25; 34 -1.75,4.25; 35 -2.25,4.25; 36 -2.75,4.25 | smd 1.2 x 0.3: 13 4.25,-2.75; 14 4.25,-2.25; 15 4.25,-1.75; 16 4.25,-1.25; 17 4.25,-0.75; 18 4.25,-0.25; 19 4.25,0.25; 20 4.25,0.75; 21 4.25,1.25; 22 4.25,1.75; 23 4.25,2.25; 24 4.25,2.75; 37 -4.25,2.75; 38 -4.25,2.25; 39 -4.25,1.75; 40 -4.25,1.25; 41 -4.25,0.75; 42 -4.25,0.25; 43 -4.25,-0.25; 44 -4.25,-0.75; 45 -4.25,-1.25; 46 -4.25,-1.75; 47 -4.25,-2.25; 48 -4.25,-2.75
SO08 = smd 0.61 x 2.21: 1 -1.905,-2.616; 2 -0.635,-2.616; 3 0.635,-2.616; 4 1.905,-2.616; 5 1.905,2.616; 6 0.635,2.616; 7 -0.635,2.616; 8 -1.905,2.616
SOIC8 = smd 0.61 x 2.21: 1 -1.905,-2.616; 2 -0.635,-2.616; 3 0.635,-2.616; 4 1.905,-2.616; 5 1.905,2.616; 6 0.635,2.616; 7 -0.635,2.616; 8 -1.905,2.616
MSOP10 = smd 0.3 x 1: 1 -1,-2.05; 2 -0.5,-2.05; 3 0,-2.05; 4 0.5,-2.05; 5 1,-2.05; 6 1,2.05; 7 0.5,2.05; 8 0,2.05; 9 -0.5,2.05; 10 -1,2.05
ENCODER-16MM-QUAD = drill 1.25: A 0,-5; B 0,0; C 0,5 | drill 2.1: P$1 -3.1,7.2; P$2 -3.1,-7.2
SOT23-5 = smd 0.55 x 1.2: 1 -0.95,-1.3; 2 0,-1.3; 3 0.95,-1.3; 4 0.95,1.3; 5 -0.95,1.3
BL125-11RL-TAGF = smd 0.3 x 0.8: 1 -1.5,-1.475; 3 -0.9,-1.475; 5 -0.3,-1.475; 7 0.3,-1.475; 9 0.9,-1.475; 11 1.5,-1.475 | smd 0.3 x 0.7: 2 -1.2,1.4; 4 -0.6,1.4; 6 0,1.4; 8 0.6,1.4; 10 1.2,1.4 | smd 0.3 x 1.15: K1 -2.3,-1.075; K2 2.3,-1.075
DIL04 = drill 0.813 pad 1.6 octagon: 1 -3.81,-3.81; 2 -1.27,-3.81; 3 -1.27,3.81; 4 -3.81,3.81
SOP8 = smd 0.55 x 1.5: 9 -1.905,-2.7; P$1 -1.905,-2.7; P$2 -0.635,-2.7; P$3 0.635,-2.7; P$4 1.905,-2.7; P$5 1.905,2.7; P$6 0.635,2.7; P$7 -0.635,2.7; P$8 -1.905,2.7
TSSOP16 = smd 0.4 x 1.6: 1 -2.225,-2.85; 2 -1.575,-2.85; 3 -0.925,-2.85; 4 -0.275,-2.85; 5 0.375,-2.85; 6 1.025,-2.85; 7 1.675,-2.85; 8 2.325,-2.85; 9 2.325,3.05; 10 1.675,3.05; 11 1.025,3.05; 12 0.375,3.05; 13 -0.275,3.05; 14 -0.925,3.05; 15 -1.575,3.05; 16 -2.225,3.05
BANANA_CONN = drill 3.81 pad 5.461: P$1 0,0

### Placement (x,y rotation side)
433  60.45,33.02 0 top
C1  11.43,16.51 90 top
C2  21.59,16.51 90 top
C3  19.81,2.54 0 top
C4  19.81,4.57 0 top
C5  16.76,4.57 180 top
C6  56.39,25.32 90 top
C7  48.77,16.26 270 top
C8  50.77,28.45 270 top
C9  48.77,28.45 270 top
C10  46.74,28.45 270 top
C11  32.26,20.32 180 top
C12  43.43,19.81 270 top
C13  43.74,31.27 225 top
C14  32.77,30.23 270 top
C15  30.23,31.24 270 top
C16  9.14,16.51 270 top
C17  77.22,61.98 90 top
C18  52.83,38.61 90 top
C19  76.45,10.41 270 top
C20  77.5,7.92 180 top
C21  77.5,5.94 0 top
C22  74.42,10.41 270 top
C23  41.38,47.32 0 top
C24  30.73,38.61 90 top
C25  23.37,74.17 270 top
C26  58.93,26.42 90 top
C27  29.21,61.21 0 top
C28  51.56,61.21 0 top
D1  24.13,16.51 270 top
D2  46.15,22.63 0 top
D3  11.43,11.43 270 top
D4  35.56,53.85 270 top
D5  45.21,56.13 180 top
D6  40.89,56.13 180 top
D7  35.56,49.78 270 top
D8  20.57,74.17 90 top
D9  17.53,74.17 90 top
D10  14.48,74.17 90 top
D11  11.18,66.04 0 top
D12  11.18,61.72 180 top
D13  22.61,37.34 90 top
D14  18.29,37.34 90 top
D15  13.97,37.34 90 top
IC1  37.85,38.61 180 top
JP1  5.08,7.62 0 top
JP4  9.4,74.17 270 top
JP5  37.08,4.83 0 top
JP6  73.66,71.12 180 top
L1  56.39,28.45 270 top
L2  71.88,11.18 90 top
M1  4.83,42.93 90 top
M2  4.83,33.27 90 top
MBRM130LT3G  72.64,7.11 0 top
OLED  55.88,16.51 270 top
OS1  45.64,25.27 180 top
R1  11.94,6.1 0 top
R2  26.67,2.03 270 top
R3  24.64,2.03 270 top
R4  21.59,12.7 0 top
R5  30.99,26.92 180 top
R6  45.72,19.81 270 top
R7  30.48,45.21 90 top
R12  76.86,67.08 0 top
R13  73.63,67.08 0 top
R14  70.43,67.08 0 top
R16  73.66,56.64 0 top
R17  78.46,10.41 270 top
R18  78.44,13.67 90 top
R19  71.88,14.73 0 top
R20  45.72,4.7 90 top
R22  29.46,49.78 270 top
R23  31.5,49.78 90 top
R24  36.58,61.47 270 top
R25  58.93,61.47 270 top
R26  39.83,77.9 0 top
R27  62.23,77.9 0 top
R28  44.5,73.96 90 top
R29  66.98,73.91 90 top
R30  29.21,71.88 180 top
R31  51.56,71.88 180 top
R32  8.89,63.75 0 top
R33  39.62,16.97 0 top
R34  36.58,16.97 180 top
R35  29.46,53.85 90 top
R36  31.5,53.85 270 top
R37  68.83,46.99 90 top
R38  68.83,43.18 90 top
R39  36.58,13.21 180 top
R40  39.62,13.21 0 top
R43  53.44,58.42 0 top
R44  50.39,58.42 0 top
R45  35.81,58.42 180 top
R46  32.77,58.42 180 top
S1  3.81,17.78 270 top
S2  44.7,14.22 270 top
S3  16.51,26.92 0 top
SERVO1  31.47,76.2 0 top
SERVO2  53.85,76.2 0 top
SJ1  22.35,2.54 270 top
SJ2  49.48,25.25 270 top
SJ3  48.26,19.81 270 top
SJ4  4.06,26.16 0 top
SJ5  69.8,56.59 270 top
SJ6  67.28,56.59 90 top
SJ7  68.33,12.19 90 bottom
SJ8  8.89,38.35 90 top
SJ9  46.23,65.53 270 top
SJ10  56.39,66.29 90 top
SJ11  24.13,65.53 270 top
SJ12  34.04,66.29 90 top
SJ13  8.64,48.03 90 top
SJ14  27.69,26.92 90 top
STLINK  30.48,17.53 270 top
SW1  73.15,26.42 180 top
U1  16.51,15.24 0 top
U2  16.76,8.13 180 top
U3  23.62,7.62 0 top
U4  38.1,25.4 90 top
U5  48.77,38.61 180 top
U6  73.66,61.98 0 top
U7  41.4,50.04 90 top
U8  72.39,44.45 0 top
U$1  [LOGO]  56.69,49.2 0 top
U$2  [LOGO]  63.83,10.11 0 bottom
U$3  75.44,13.72 90 top
U$4  71.88,2.79 90 top
U$5  43.43,71.55 0 top
U$6  65.86,71.55 0 top
U$7  51.56,65.79 270 top
U$8  29.21,65.79 270 top
U$9  63.5,26.42 180 top
U$10  [ESD_10.00]  13.03,54.36 0 top
USART  30.48,2.03 90 top
V+  4.06,63.75 0 top
V-  4.06,55.63 0 top

### Tracks (layer width: path | path; a pad name or v marks a point on that pad's centre or on a via)
3.3V  (via drill 0.3)  (1 unrouted)
  Top 0.203: U$3.4 U$3.5 | U$3.5 74.95,12.77 C19.1 | U$3.5 73.85,12.77 73.41,12.32 73.41,11.3 L2.1 | L2.1 71.5,9.78 v70.36,9.78 | U$4.7 72.39,3.09 71.88,3.61 L2.1 | R2.2 27.42,0.43 31.24,0.43 32.87,2.06 32.87,6.15 34.4,7.68 JP5.2 35,7.22 v35,4.75 | U4.36 33.14,22.65 32.66,22.17 32.66,20.76 C11.1 33.11,20.03 STLINK.1 | U4.48 40.85,20.59 41.22,20.22 | 41.22,20.22 42.99,20.22 C12.1 | R34.2 35.73,14.37 | 35.73,14.37 R39.2 | 40.47,14.25 R33.2 41.22,17.72 41.22,20.22 | 40.47,14.25 R40.2 | C17.1 74.05,61.13 71.78,63.4 71.78,64.57 U6.8 71.75,65.96 71.55,66.17 69.9,66.17 69.57,66.5 69.57,67.07 R14.1 | C23.1 40.53,49.54 40.03,50.04 U7.8 38.61,50.04 37.47,48.9 35.87,48.9 35.59,49.17 | L1.2 C6.2 | C14.1 34.19,29.65 U4.24 | v35.81,14.33 35.73,14.37 | v40.39,14.33 40.47,14.25 | D7.2 35.24,48.83 35.59,49.17 | 35.59,49.17 35.59,53.39 | 35.59,53.39 35.59,55.3 34.44,56.44 31.57,56.44 28.35,59.66 28.35,61.2 C27.1 | D4.2 35.09,52.9 35.59,53.39
  Top 0.33: 44.78,21.54 46.93,21.54
  Top 0.406: 51.97,24.43 53.71,26.17 C6.2 57.63,27.41 v57.63,32.82 | 51.97,24.43 SJ2.3 46.68,24.43 OS1.4 | 51.97,24.43 50.16,22.63 D2.A 46.93,21.54 | C13.1 45.9,33.43 49.55,33.43 50.65,34.52 50.65,35.97 U5.8 50.67,37.16 51.26,37.74 52.82,37.74 C18.1 52.87,37.8 53.59,37.8 55.7,39.9 55.7,42.65 | SJ8.1 9.88,37.54 10.34,38 v10.34,42.55 | v10.31,46.46 10.31,46.76 9.88,47.19 8.66,47.19 SJ13.1 | v12.14,39.8 12.09,39.75 12.09,36.8 13.06,35.84 D15.A D14.A D13.A 22.61,32.89 21.34,31.62 21.34,28.6 22.43,27.51 | 22.43,27.51 24.36,27.51 26.7,29.84 30.76,29.84 30.84,29.92 | 30.84,29.92 30.3,29.92 C15.A | 30.84,29.92 31.61,29.92 C14.1 | 22.43,27.51 23.82,26.11 SJ14.1 27.69,25.43 26.31,24.05 26.31,19.53 27.84,18.01 | D6.2 39.94,58.08 40.08,58.22 | 40.08,58.22 40.44,58.57 43.81,58.57 | 43.81,58.57 44.25,58.14 44.25,57.25 D5.2 | 40.08,58.22 37.68,60.62 R24.2 36.56,60.63 35.66,60.63 34.04,62.26 SJ12.1 33.71,65.15 U$8.P$6 31.89,65.18 30.63,65.18 28.36,62.9 C27.1 25.38,61.21 24.13,62.46 SJ11.3 | 46.46,61.21 C28.1 50.72,61.23 50.72,62.87 53.01,65.15 U$7.P$6 54.31,65.2 55.3,65.2 55.58,65.48 SJ10.1 56.41,65.46 56.41,62.36 58.15,60.62 R25.2 63.12,60.62 | 46.46,61.21 43.81,58.57 | 46.46,61.21 46.46,64.49 SJ9.3 | 63.12,60.62 R14.1 | 63.12,60.62 63.12,60.58 55.7,53.16 55.7,45.29 | 55.7,45.29 55.7,42.65 | R38.2 68.19,44.03 67.41,44.81 | 67.41,44.81 67.41,46.42 R37.2 | 67.41,44.81 67.41,41.43 v65.96,39.98 | v58.19,42.85 58.14,42.85 55.7,45.29 | 40.51,47.32 40.51,46.61 40.95,46.18 v44.78,46.18 | C12.1 43.43,21.13 43.81,21.54 44.78,21.54 | 24.16,62.71 10.24,48.79 10.24,46.48 | v51.87,46.2 52.15,46.2 55.7,42.65
  Top 0.508: U1.2 v16.51,13.97 | v16.51,16 U1.4 21.16,18.34 C2.A 24.03,17.91 D1.A | JP5.2 34.54,12.03 R39.2 | 29.75,30.31 C15.A
  Top 0.61: D1.A 27.84,18.01 30.12,18.01 STLINK.1 34.54,13.59 34.54,12.03 | D2.A 48.05,20.83 SJ3.1
  Bottom 0.203: v70.36,9.78 SJ7.1 68.33,8.89 67.82,8.38 64.34,8.38 58.75,13.97 OLED.2 52.25,13.97 47.93,9.65 43.94,9.65 38.66,4.37 35.38,4.37 v35,4.75 | v40.39,14.33 v35.81,14.33
  Bottom 0.406: v10.31,46.46 10.34,46.43 v10.34,42.55 12.14,40.74 v12.14,39.8 | v65.96,39.98 61.06,39.98 v58.19,42.85 58.19,33.78 57.63,33.22 v57.63,32.82 | v44.78,46.18 v51.87,46.2
  Bottom 0.508: v16.51,13.97 v16.51,16
15V
  Top 0.203: R17.2 78.46,8.04 C20.1 77.53,7.11 MBRM130LT3G.C 74.79,4.46 74.02,3.68 U$4.9
433_D0
  Top 0.203: SW1.9 68.71,24.05 67.59,25.17 66.78,25.17 63.8,28.14 63.8,29.24 U$9.4 63.77,30.27 65.58,32.08 65.58,33.1 433.3
433_D1
  Top 0.203: SW1.10 69.95,22.74 69.95,23.95 68.3,25.6 67,25.6 64.42,28.18 U$9.3 64.42,30.14 66.22,31.93 67.11,31.93 433.4
433_D2
  Top 0.203: SW1.11 71.22,22.74 71.22,23.98 69.19,26.01 67.26,26.01 65.08,28.19 U$9.2 65.08,30.1 66.37,31.39 68.86,31.39 433.5
433_D3
  Top 0.203: SW1.12 72.52,24.05 70.18,26.39 67.56,26.39 65.72,28.23 U$9.1 66.17,29.27 67.94,31.04 71.27,31.04 433.6
485_A
  Top 0.203: R12.1 74.3,65.37 U6.6 74.3,63.4 73.91,63.02 72.72,63.02 72.39,63.35 72.39,65.91 71.28,67.02 R14.2 71.28,70.96 JP6.P$2
485_B
  Top 0.203: U6.7 73.03,66.84 R13.1
  Top 0.406: 73.03,66.84 72.82,67.04 72.82,68 73.97,69.14 74.22,69.14 | 74.22,69.14 76.28,69.14 77.71,67.7 R12.2 | JP6.P$1 74.22,69.14
485_RE
  Top 0.203: R16.2 73.26,54.57 72.9,54.2 67.92,54.2 66.06,52.35 66.06,52.32 65.73,51.99 65.73,43.23 53.19,30.68 45.95,30.68 45.34,30.07 45.34,29.72 43.27,27.65 U4.11
485_SHDN
  Top 0.203: R16.3 74.06,54.27 73.43,53.65 68.2,53.65 66.32,51.77 66.32,43.16 53.39,30.25 46.1,30.25 45.77,29.92 45.77,29.57 43.35,27.15 U4.10
595_RCLK
  Top 0.203: U4.19 37.85,31.85 37.19,32.51 37.19,35.51 IC1.12
595_SER
  Top 0.203: U4.18 38.35,31.14 39.75,32.54 IC1.14
595_SRCLK
  Top 0.203: U4.21 36.85,31.65 35.94,32.56 IC1.11
595_SRCLR
  Top 0.203: U4.22 36.35,30.91 34.65,32.61 34.65,35.89 34.67,35.92 | IC1.10 34.67,35.92 | 34.67,35.92 34.8,36.04
ADC_CS  (via drill 0.3)
  Top 0.203: IC1.3 39.75,43.1 v40.01,43.36 | v47.07,47.6 47.09,47.6 47.8,48.31 47.8,49.23 47.3,49.73 45.21,49.73 45.01,49.53 U7.2
  Bottom 0.203: v40.01,43.36 40.01,43.43 44.17,47.6 v47.07,47.6
CLK_16M
  Top 0.203: U4.5 44.77,24.65 OS1.3
D+
  Top 0.254: JP1.D+ 14.21,7.62 U2.2 15.81,9.08 16.76,8.13 18.29,8.13 18.8,7.62 U3.4
D-  (via drill 0.3)
  Top 0.254: U3.5 19.05,7.11 18.8,6.86 18.8,6.35 18.29,5.84 16.76,5.84 15.81,6.79 U2.3 15.64,6.86 v14.48,6.86 | JP1.D- 12.92,8.42 v12.95,8.38
  Bottom 0.254: v12.95,8.38 v14.48,6.86
EEPROM_CS  (via drill 0.3)
  Top 0.203: IC1.4 38.48,43.28 39.37,44.17 v44.2,44.17 | v50.67,43.54 U5.1
  Bottom 0.203: v44.2,44.17 50.04,44.17 v50.67,43.54
GND  (via drill 0.3)  (1 unrouted)
  Top 0.203: R18.1 78.44,12.85 78.33,12.85 77.47,13.72 U$3.2 | C17.2 76.14,62.83 75.56,63.4 U6.5 | C23.2 42.23,49.52 42.75,50.04 U7.3 | U4.47 40.35,21.86 40.56,22.07 41.5,22.07 v42.22,21.36 | 75.59,14.33 76.2,13.72 | U4.35 35.22,23.15 v35.53,23.47 | U4.23 35.85,28.25 v35.76,28.17
  Top 0.254: C5.2 14.31,4.57 R1.2 | 20.12,8.13 20.12,8.12 U3.3 19.18,8.12 19.13,8.18 19.13,9.5 v19.41,9.78 | U3.M 21.47,9.72 20.98,10.21
  Top 0.305: U4.23 35.85,30.62 35.81,30.66 | U4.35 32.88,23.15 32.82,23.09 | OS1.2 44.78,25.91 43.71,25.91 43.47,26.15 U4.8 41.06,26.15 41.05,26.16
  Top 0.406: S2.1 46.61,16.84 45.97,16.2
  Bottom 0.406: OLED.1 52.98,16.51 52.98,16.54
  other vias: 57.81,0.58 58.42,2.54 58.42,5.08 58.42,7.62 58.42,10.16 75.34,8.48 73.58,7.8 58.42,15.24 60.96,15.24 63.5,15.24 66.04,15.24 63.5,12.7 59.69,16.51 62.23,16.51 64.77,16.51 67.31,16.51 69.85,16.51 72.39,16.51 74.93,16.51 77.47,16.51 62.23,13.97 64.77,13.97 64.77,11.43 59.69,11.43 60.96,10.16 62.23,8.89 63.5,7.62 64.77,6.35 59.69,8.89 60.96,7.62 62.23,6.35 63.5,5.08 59.69,6.35 60.96,5.08 62.23,3.81 59.69,3.81 66.04,5.08 67.31,3.81 64.77,3.81 76.2,3.81 78.74,3.81 77.47,2.54 74.93,2.54 76.2,1.27 78.74,1.27 68.58,7.62 69.85,13.97 60.2,52.1 33.53,60.55 26.95,51.97 36.02,47.19 43.38,48.16 31.34,42.55 27,37.54 31.29,35.26 25.83,27.38 42.19,29.9 35.59,25.43 34.09,21.64 44.15,17.35 47.57,16.21 47.93,13.46 40.77,10.29 47.96,34.29 23.6,7.57 16.59,2.36 47.65,7.7 41.91,1.65 32.59,8.53 77.32,64.92 75.08,68.28 73.63,74.5 30.4,62.79 29.24,66.8 36.4,66.67 23.27,68.2 23.52,1.65 55.88,23.11 61.72,26.92 53.04,41.94 41,60.81 43.28,62.81 37.03,56.87 43,55.3 43,53.39 47.57,59.56 47.65,56.97 27.43,57.45 59.26,21.46 57.45,19.13 55.8,21.44 67.03,22.07 78.28,20.45 31.22,22.17 29.79,20.32 28.88,25.25 45.01,27 22.15,44.75 18.95,41.88 26.06,44.12 23.24,41.91 50.93,5.61 51.16,2.59 28.04,76.07 48.67,76.02
  pour Top (isolate 0.127): 54.61,17.78 81.28,17.78 81.28,-1.27 54.61,-1.27
  pour Bottom (isolate 0.127): 54.61,17.78 82.55,17.78 82.55,-1.27 54.61,-1.27
  pour Top (isolate 0.381, rank 6): -8.15,88.98 97.43,88.98 95.3,18.44 53.52,18.67 53.37,-2.24 -8.15,-3.28
  pour Bottom (isolate 0.381, rank 6): -3.58,101.24 88.34,101.24 88.09,18.64 53.06,18.9 53.29,-1.91 -2.95,-2.49
I2C1_SCL
  Top 0.203: U4.42 37.85,20.39 38.12,20.12 38.12,19.07 37.44,18.39 37.44,16.98 R34.1 R39.1 37.43,8.02 JP5.4 37.08,6.4 39.98,3.5 R20.8
I2C1_SDA
  Top 0.203: U4.43 38.35,20.48 38.56,20.27 38.56,19.1 38.79,18.87 38.79,16.98 R33.1 R40.1 38.77,8.53 JP5.6 39.62,6.4 41.71,4.32 45.08,4.32 R20.7
MP_A  (via drill 0.3)
  Top 0.203: U4.38 35.84,21.16 35.84,22.23 40.41,26.8 v40.46,26.8 | v51.92,27.74 52.88,28.7 v54.79,28.7 | v62.43,30.84 63.12,30.14 U$9.5
  Bottom 0.203: v40.46,26.8 41.4,27.74 v51.92,27.74 | v54.79,28.7 56.77,30.84 v62.43,30.84
MP_S0  (via drill 0.3)
  Top 0.203: U4.39 36.35,18.59 arc90 v36.75,18.21 | v62.46,19.91 arc90 62.48,19.93 U$9.11
  Bottom 0.203: v36.75,18.21 52.22,18.21 53.75,19.74 62.28,19.74 v62.46,19.91
MP_S1  (via drill 0.3)
  Top 0.203: U4.40 36.85,19.23 arc90 v37.08,19.05 | v61.82,20.78 arc90 v61.83,20.78 U$9.10
  Bottom 0.203: v37.08,19.05 52.48,19.05 53.57,20.14 61.19,20.14 v61.82,20.78
MP_S2  (via drill 0.3)
  Top 0.203: U4.41 arc-90 37.36,21.14 37.36,19.94 arc90 v37.49,19.81 | v61.16,21.67 arc90 61.17,21.68 U$9.9
  Bottom 0.203: 61.16,21.44 v61.16,21.67 60.07,20.57 53.42,20.57 52.65,19.81 v37.49,19.81
N$1
  Top 0.254: JP1.GND 11.01,6.02 R1.1
N$2
  Top 0.203: U3.11 23.62,4.55 24.64,3.53 R3.1
N$3
  Top 0.406: D1.C 24.13,14.39 R4.2
N$4
  Top 0.203: D2.C 42.37,22.63 U4.1
N$5
  Top 0.203: SJ4.1 2.79,21.34 6.35,17.78 S1.2 6.38,17.53 5.59,17.53 4.57,16.51 4.57,16.48 | 4.57,10.92 4.57,10.41 4.5,10.41 4.01,9.93 4.01,9.37 4.37,9.02 5.69,9.02 5.89,9.22 6.61,9.22 6.69,9.14 6.77,9.23
  Top 0.254: JP1.VBUS 6.77,9.23 | 4.57,10.92 4.57,16.48
N$6
  Top 0.203: U4.9 43.41,26.65 46.05,29.29 46.72,29.29 C10.1 C9.1 C8.1 54.16,29.3 54.36,29.49 55.19,29.49 55.4,29.29 56.38,29.29 L1.1
N$7  (via drill 0.3)
  Top 0.203: U4.44 38.85,20.51 39.62,19.74 39.62,16.18 v39.83,15.9 | v45.41,17.3 45.41,18.66 R6.2
  Bottom 0.203: v39.83,15.9 44.02,15.9 v45.41,17.3
N$9
  Top 0.203: R6.1 46.57,19.81 SJ3.2
N$10
  Top 0.203: U3.9 22.62,3.26 SJ1.1 23.12,2.99 24.11,2.01 25.8,2.01 R2.1
N$11
  Top 0.203: OS1.1 47.86,25.92 48.54,25.25 SJ2.2
N$12
  Top 0.406: C16.1 10.88,17.36 C1.A
  Top 0.508: U1.3 18.82,13.69 17.78,14.99 14.22,14.99 12.7,13.21 11.55,13.21 D3.C 10.55,13.33 9.65,14.22 8.64,14.22 8.13,14.73 8.13,16.34 C16.1
N$14
  Top 0.203: R17.1 78.6,11.26 79.43,12.09 79.43,13.53 R18.2 78.28,14.67 U$3.3
N$15
  Top 0.203: U3.6 19.61,6.63 19.38,6.4 19.38,6.04 18.67,5.33 17.98,5.33 17.61,4.96 C5.1
N$16
  Top 0.203: R7.2 32.71,44.81 34.67,42.85 IC1.7
N$17
  Top 0.203: R7.3 33.26,45.61 35.94,42.93 IC1.6
N$18  (via drill 0.3)
  Top 0.203: MBRM130LT3G.A 69.67,7.93 69.67,10.79 71.45,12.58 L2.2 73.05,13.74 v73.43,13.74 | U$3.1 75.98,12.77 v75.29,13.46
  Bottom 0.203: v75.29,13.46 74.35,13.46 73.97,13.84 73.48,13.84 v73.43,13.74
N$19
  Top 0.203: R7.4 33.73,46.41 37.21,42.93 IC1.5
N$20  (via drill 0.3)
  Top 0.203: U$4.10 70.48,4.72 v70.46,4.72 | v72.8,7.04 72.8,7.92 73.53,8.66 73.53,10.38 C22.1 | v75.56,5.84 C21.1
  Bottom 0.203: v70.46,4.72 v72.8,7.04 72.8,6.25 73.18,5.84 v75.56,5.84
N$21  (via drill 0.3)
  Top 0.203: U$4.1 72.49,1.29 71.5,2.29 71.5,4.72 70.56,5.66 69.19,5.66 67.87,6.99 67.87,7.82 v66.6,9.09
  Bottom 0.203: v66.6,9.09 66.6,11.51 67.28,12.19 SJ7.2
N$22
  Top 0.203: R7.5 21.54,46.41 D15.C
N$23
  Top 0.203: R7.6 25.06,45.61 D14.C
N$24
  Top 0.203: R16.8 72.46,57.46 71.75,58.17 U6.1
N$25
  Top 0.203: R16.6 74.06,57.75 74.3,57.99 U6.3
N$26
  Top 0.203: R16.5 74.86,57.54 75.56,58.24 U6.4
N$27
  Top 0.203: R16.7 73.26,57.78 73.03,58.01 U6.2
N$28  (via drill 0.3)
  Top 0.203: R16.1 v71.16,56.02 v71.14,56.01 | v68.56,56.59 SJ6.2
  Bottom 0.203: v71.14,56.01 69.14,56.01 v68.56,56.59
N$29
  Top 0.406: U$5.1 R24.1
N$30
  Top 0.203: R22.2 19.57,48.93 11.25,40.62 11.25,37.44 9.68,35.87 5,35.87 M2.2
N$31
  Top 0.203: R16.4 74.78,56.1 74.78,56.54 74.7,56.62 71.58,56.62 71.5,56.69 70.74,56.69 70.64,56.59 SJ5.2
N$32
  Top 0.203: R19.1 68.2,14.73 65.73,12.27 65.73,8.33 69.6,4.47 69.6,3.71 69.93,3.38 70.47,3.38 U$4.8
N$33  (via drill 0.3)
  Top 0.203: U7.7 38.5,50.54 37.77,49.81 36.69,49.81 D7.3
  Top 0.305: R23.2 R22.1
  Top 0.406: D7.3 36.66,50.49 v36.25,50.9 | v32.84,50.65 31.51,50.65 R23.2
  Bottom 0.406: v32.84,50.65 35.99,50.65 v36.25,50.9
N$34
  Top 0.406: U$6.1 R25.1
N$35
  Top 0.406: R30.1 31.46,67.69 U$8.P$8
  Top 1.016: SERVO1.1 R30.1
N$36
  Top 0.203: SJ8.2 M2.3
N$37
  Top 0.406: R31.1 53.81,67.69 U$7.P$8
  Top 1.016: SERVO2.1 53.85,72.57 53.9,72.57 53.9,71.88 R31.1
N$38
  Top 1.016: R28.2 44.5,75.36 U$5.3
N$39
  Top 1.016: R29.2 66.98,75.36 U$6.3
N$40
  Top 0.203: U$7.P$3 47.62,65.15 47.24,65.53 SJ9.2
N$41
  Top 0.203: SJ10.2 54.39,66.29 U$7.P$7
N$42
  Top 0.254: U$8.P$3 25.38,65.15 24.99,65.53 SJ11.2
N$43
  Top 0.203: SJ12.2 32.04,66.29 U$8.P$7
N$44
  Top 0.406: D12.C 9.79,61.72 R32.2 9.79,66.04 D11.A
N$45
  Top 0.203: SJ13.2 4.72,48.03 M1.3
N$46  (via drill 0.3)
  Top 0.203: U7.6 39.35,52.88 38.38,53.85 D4.3
  Top 0.406: R35.1 30.71,53 | 30.71,53 R36.2 | D4.3 36.66,53.12 v36.25,52.7 | v32.87,53.01 30.72,53.01 30.71,53
  Bottom 0.406: 32.89,53.03 v32.87,53.01 33.17,52.7 v36.25,52.7
N$47
  Top 0.203: M1.2 14.07,45.47 23.32,54.71 29.45,54.71 R35.2
N$48
  Top 0.203: R5.2 SJ14.2
N$49
  Top 0.203: U7.5 44.48,51.04 45.19,51.74 45.19,55.01 D5.3
  Top 0.406: R43.1 R44.2 51.24,57.01 49.28,55.04 45.22,55.04 D5.3
N$50
  Top 0.203: U7.4 42.15,50.54 40.89,51.79 D6.3
  Top 0.406: R46.1 R45.2 34.96,57.09 37.03,55.02 40.88,55.02 D6.3
N$55
  Top 0.203: U$9.15 65.08,21.67 65.63,21.08 72.8,21.08 73.79,21.79 SW1.13
N$56
  Top 0.203: U$9.14 64.42,21.58 65.43,20.57 73.51,20.57 75.08,21.79 75.08,22.69 SW1.14
N$57
  Top 0.203: U$9.13 63.77,21.44 65.13,20.07 74.12,20.07 76.33,21.79 SW1.15
N$58
  Top 0.203: U$9.12 63.12,23.35 63.09,23.32 63.09,21.39 64.9,19.56 74.68,19.56 77.6,21.79 SW1.16
N$59
  Top 0.203: R7.7 28.58,44.81 D13.C
N$63
  Top 0.203: R7.8 29.18,44.01 24.64,39.47 24.64,32.89 23.5,31.75 23.5,29.43 S3.3
NRST  (via drill 0.3)
  Top 0.203: U4.7 40.92,25.65 37.87,22.61 v37.87,22.58 | v41.63,17.02 S2.3
  Top 0.406: S2.3 44.46,15.18 44.46,15.15 44.91,14.71 48.07,14.71 C7.2
  Bottom 0.203: v37.87,22.58 35.46,20.17 35.46,17.86 36.3,17.02 v41.63,17.02
OLED_CS  (via drill 0.3)
  Top 0.203: U$4.5 72.45,2.49 v72.44,2.46 | OLED.4 52.6,8.89 | 52.6,8.89 arc45 51.7,8.52 48.65,5.47 arc-45 47.75,5.1 R20.3 arc45 46.39,5.08 | IC1.1 v44.53,41.68 | v51.87,21.36 51.87,9.62 52.6,8.89
  Bottom 0.203: v72.44,2.46 62.15,2.49 OLED.4 | v44.53,41.68 46.58,41.68 48.82,39.45 48.82,32.89 53.42,28.3 53.42,22.91 v51.87,21.36
OLED_DC  (via drill 0.3)
  Top 0.203: U$4.4 60.16,2.19 OLED.5 | IC1.15 41.02,33.88 v41.27,33.63 | v50.83,21.36 v50.83,9.65
  Bottom 0.203: v41.27,33.63 47.22,33.63 52.63,28.22 52.63,23.16 v50.83,21.36 | v50.83,9.65 50.83,8.59 53.01,6.4 55.96,6.4 OLED.5
OLED_RST  (via drill 0.3)
  Top 0.203: U$4.6 64.64,2.79 OLED.3 55.98,11.46 52.96,11.46 52.53,11.89 52.53,20.6 52.96,21.03 v52.96,21.36 | IC1.2 41.02,43.1 41.35,43.43 44.5,43.43 v45.24,42.7
  Bottom 0.203: v45.24,42.7 46.35,42.7 49.63,39.42 49.63,33.02 54.23,28.42 54.23,22.63 v52.96,21.36
OLED_SCL
  Top 0.203: U$4.2 56.33,1.59 OLED.7 50.69,1.27 arc-45 49.79,1.64 48.31,3.13 arc45 47.41,3.5 R20.1
OLED_SDA  (via drill 0.3)
  Top 0.152: 72.01,0.89 73.95,0.89 74.01,0.93
  Top 0.203: U$4.3 73.95,1.89 74.22,1.63 74.22,1.12 74.01,0.93 73.94,0.86 | OLED.6 49.42,3.81 arc-45 49.04,3.97 48.92,4.09 arc45 48.41,4.3 R20.2 | v63.27,0.86 72.01,0.89
  Bottom 0.203: v63.27,0.86 58.7,0.86 OLED.6
OURET  (via drill 0.3)
  Top 0.203: U4.20 37.36,29.64 37.36,28.25 36.04,26.92 v35.23,26.92 | v32.66,26.95 32.64,26.92 R5.1
  Bottom 0.203: v35.23,26.92 35.2,26.95 v32.66,26.95
S1
  Top 1.016: SERVO1.3 36.55,75.36 U$5.4 38.98,75.36 R26.1
S2
  Top 1.016: SERVO2.3 58.93,75.36 U$6.4 61.38,75.36 R27.1
SERVO1_OUTPUT
  Top 0.406: U$8.P$5 R46.2
SERVO2_OUTPUT
  Top 0.406: U$7.P$5 54.26,58.45 R43.2
SPI1_MISO
  Top 0.203: U4.16 39.35,30.51 40.44,31.6 41.66,31.6 45.06,35 45.06,37.82 46.89,39.65 46.89,41.2 U5.4 46.86,42.82 44.6,45.09 39.34,45.09 37.87,46.56 37.87,48.77 38.63,49.53 U7.9
SPI1_MOSI  (via drill 0.3)
  Top 0.203: U4.17 38.85,30.77 40.13,32.05 41.35,32.05 43.2,33.91 43.23,33.91 43.71,34.39 43.71,37.77 v44.78,38.84 | v47.4,38.89 48.13,39.62 U5.3 48.11,41.25 48.11,42.8 45.41,45.49 39.57,45.49 38.3,46.76 38.3,48.56 38.78,49.04 U7.10
  Bottom 0.203: v44.78,38.84 47.37,38.89 v47.4,38.89
SPI1_SCK
  Top 0.203: U4.15 39.85,30.35 40.51,31.01 41.88,31.01 45.7,34.82 45.7,37.03 46.48,37.82 47.5,37.82 49.43,39.75 49.43,41.2 U5.2 49.4,43.99 44.35,49.05 U7.1
SW  (via drill 0.3)
  Top 0.203: U4.25 v31.4,28.15 v31.39,28.14 | v25.53,24.43 23.5,24.43 S3.1
  Bottom 0.203: v31.39,28.14 29.23,28.14 v25.53,24.43
SWCLK  (via drill 0.3)
  Top 0.203: U4.37 34.65,20.45 v34.65,15.65
  Bottom 0.203: v34.65,15.65 34.65,14.2 STLINK.4
SWDIO  (via drill 0.3)
  Top 0.203: U4.34 30.58,23.65 v28.4,21.46
  Bottom 0.203: v28.4,21.46 28.4,14.66 STLINK.3
TIM1_CH1  (via drill 0.3)
  Top 0.203: U4.29 33.86,26.14 36.12,26.14 v36.93,26.95
  Bottom 0.203: v36.93,26.95 38.38,28.4 38.38,61.9 42.16,65.68 U$5.2
TIM1_CH4  (via drill 0.3)
  Top 0.203: U4.32 33.89,24.61 36.3,24.61 38.08,26.39 v38.08,26.42
  Bottom 0.203: v38.08,26.42 39.04,27.38 39.04,46.63 42.6,50.19 49.61,50.19 64.59,65.18 U$6.2
TIM4_CH3  (via drill 0.3)
  Top 0.203: U4.45 39.35,23.2 v40.26,24.11 | v50.9,26.19 51.56,26.19 53.19,27.81 v54.86,27.81
  Top 0.406: U8.B 72.39,44.37 70.38,42.37 68.87,42.37 R38.1
  Bottom 0.203: v40.26,24.11 42.34,26.19 v50.9,26.19 | v54.86,27.81 56.36,29.49 75.46,29.49 77.47,31.5 77.47,33.91 73.33,38.05 71.48,38.05 70.79,38.73 70.79,40.77 72.39,42.37 U8.B
TIM4_CH4  (via drill 0.3)
  Top 0.203: U4.46 39.85,22.3 v40.26,22.71 | v51.54,25.3 53.16,26.92 v55.02,26.92
  Top 0.406: R37.1 73.42,46.14 74.78,44.78 74.78,41.84 U8.A
  Bottom 0.203: v40.26,22.71 42.85,25.3 v51.54,25.3 | v55.02,26.92 56.84,28.88 75.95,28.88 78.05,30.99 78.05,34.27 72.87,39.45 U8.A
USART1_RX  (via drill 0.3)
  Top 0.203: U3.26 23.12,11.54 26.09,14.5 v26.09,16 | v27.99,23.85 28.4,24.26 30.96,24.26 31.86,25.15 U4.31
  Bottom 0.203: USART.1 30.35,2.54 27.76,5.13 27.76,13.84 26.09,15.52 v26.09,16 26.09,21.95 v27.99,23.85
USART1_TX  (via drill 0.3)
  Top 0.203: USART.2 30.28,4.57 27,7.85 v27,16.74 27,14.5 23.62,11.12 U3.25 | v30.33,25.2 30.78,25.65 U4.30
  Bottom 0.203: v27,16.74 27,21.87 v30.33,25.2
USART2_RX
  Top 0.203: U4.13 41.29,29.65 41.99,28.96 43,28.96 45.67,31.62 52.73,31.62 64.54,43.43 64.54,55.32 66.62,57.4 SJ6.3 SJ5.1
USART2_TX
  Top 0.203: U4.12 43.21,28.15 44.93,29.87 44.93,30.3 45.82,31.19 53.01,31.19 65.15,43.33 65.15,54.38 66.55,55.78 SJ6.1 SJ5.3
V+  (via drill 0.3)
  Top 1.016: SERVO1.2 34.01,78.94 34.06,78.94 | SERVO2.2 56.39,79.07 56.29,79.07
  other vias: 42.93,78.99 43.94,78.99 44.96,78.99 45.97,78.99 46.99,78.99 48.01,78.99 49.02,78.99 50.04,78.99 51.05,78.99 52.07,78.99 41.91,78.99 30.23,78.99 29.21,78.99 28.19,78.99 27.18,78.99 26.16,78.99 25.15,78.99 24.13,78.99 23.11,78.99 22.1,78.99 21.08,78.99 20.07,78.99 19.05,78.99 18.03,78.99 17.02,78.99 16,78.99 14.99,78.99 15.49,78.23 16,77.47 16.51,78.23 17.02,77.47 17.53,78.23 18.03,77.47 18.54,78.23 19.05,77.47 19.56,78.23 20.07,77.47 20.57,78.23 21.08,77.47 21.59,78.23 22.1,77.47 22.61,78.23 23.11,77.47 23.62,78.23 24.13,77.47 24.64,78.23
  pour Bottom (isolate 0.381, no thermals): -1.32,82.09 -1.32,74.73 26.09,74.73 26.09,78.41 67.28,78.41 67.28,82.09
  pour Top (isolate 0.381, no thermals): -2.34,81.99 -2.34,74.63 25.07,74.63 25.07,78.31 66.27,78.31 66.27,81.99
  pour Top (no thermals): 5.08,80.26 5.08,68.58 8.13,65.53 8.13,62.23 6.6,60.71 -0.76,60.71 -1.52,61.47 -1.52,80.01 -0.51,81.03 4.32,81.03
V-  (via drill 0.3)
  Top 0.406: R30.2 26.96,67.69 U$8.P$1 | R31.2 49.31,67.69 U$7.P$1
  other vias: 24.64,71.12 24.64,71.88 24.64,72.64 24.64,70.36 23.88,70.61 23.88,71.37 23.88,72.14 23.11,71.63 23.11,70.87 37.85,73.15 37.85,72.39 37.85,71.63 37.85,70.87 38.61,72.64 38.61,71.88 38.61,71.12 38.61,70.36 39.37,72.14 39.37,72.9 38.61,73.41 39.37,71.37 39.37,70.61 40.13,72.39 40.13,71.63 40.13,70.87 40.13,73.15 40.89,73.41 40.89,72.64 40.89,71.88 40.89,71.12 40.89,70.36 41.66,72.9 41.66,72.14 41.66,71.37 41.66,70.61 42.42,73.15 42.42,72.39 42.42,71.63 42.42,70.87 43.18,73.41 43.18,72.64 43.18,71.88 43.18,71.12 43.18,70.36 60.96,73.15 60.96,72.39 60.96,71.63 60.96,70.87 61.72,73.41 61.72,72.64 61.72,71.88 61.72,71.12 62.48,72.9 62.48,72.14 63.25,72.39 63.25,73.15 62.48,71.37 63.25,71.63 62.48,70.61 63.25,70.87 64.01,73.41 64.01,72.64 64.01,71.88 64.01,71.12
  pour Top (isolate 0.381, no thermals): 28.37,70.23 28.37,73.56 6.86,73.56 6.86,70.23
  pour Bottom (isolate 0.381, no thermals): 6.45,70.28 6.45,73.56 67.41,73.58 67.41,70.31
  pour Top (no thermals): 50.7,73.53 50.7,70.28 34.39,70.28 34.39,73.53
  pour Top (no thermals): 67.39,73.53 67.39,70.28 56.87,70.33 56.87,73.58
  pour Top (no thermals): 6.35,70.36 8.38,68.33 11.18,68.33 11.94,67.56 11.94,60.2 10.16,58.42 -0.76,58.42 -1.02,58.17 -1.02,52.07 11.94,52.07 18.29,58.42 18.29,68.33 20.07,70.1 20.07,70.36
VBUS  (via drill 0.3)
  Top 0.203: U$9.16 65.72,25.08 65.23,25.58 C26.1 | 42.29,36.63 IC1.16 | 60.02,30.2 60.02,26.24 58.93,25.15 58.93,24.13 56.9,22.1 50.29,22.1 49.78,21.59 49.78,12.45 v42.67,5.33 | v21.59,1.02 20.66,1.94 C3.2
  Top 0.406: C26.1 59.42,25.57 60.02,26.16 60.02,30.2 60.91,31.09 61.19,31.09 433.2 | SJ13.3 7.52,48.84 6.35,50.01 3.15,50.01 2.06,48.92 2.06,39.55 | 2.06,39.55 2.06,29.44 SJ4.2 8.13,23.37 8.13,17.27 6.63,15.78 S1.3 6.63,14.51 5.59,13.46 5.59,10.67 6.1,10.16 10.8,10.16 D3.A 13.33,9.53 v13.46,9.4 | SJ8.3 7.59,39.17 6.2,40.56 3.07,40.56 2.06,39.55 | v20.22,5.59 20.29,5.56 | v26.42,33.02 30.73,37.34 C24.1 41.16,37.76 42.29,36.63
  Bottom 0.203: v42.67,5.33 37.8,0.46 29.79,0.46 29.23,1.02 v21.59,1.02
  Bottom 0.406: v13.46,9.4 17.02,5.84 20.07,5.84 v20.22,5.59 | v26.42,33.02 20.83,27.43 6.6,27.43 SJ4.2
  pour Top (no thermals): 20.24,4.19 22.17,4.19 22.17,5.89 21.92,5.89 21.92,6.17 20.24,6.17
  pour Top (no thermals): 21.16,4.17 21.16,2.13 20.19,2.13 20.19,4.17

### Text on the board
tNames: DextaRobotics | Oct 21, 2015 | PJ7 | STB REV A